# Altium project SENSEI_Base-Board.PrjPcb (part 1 of 3)
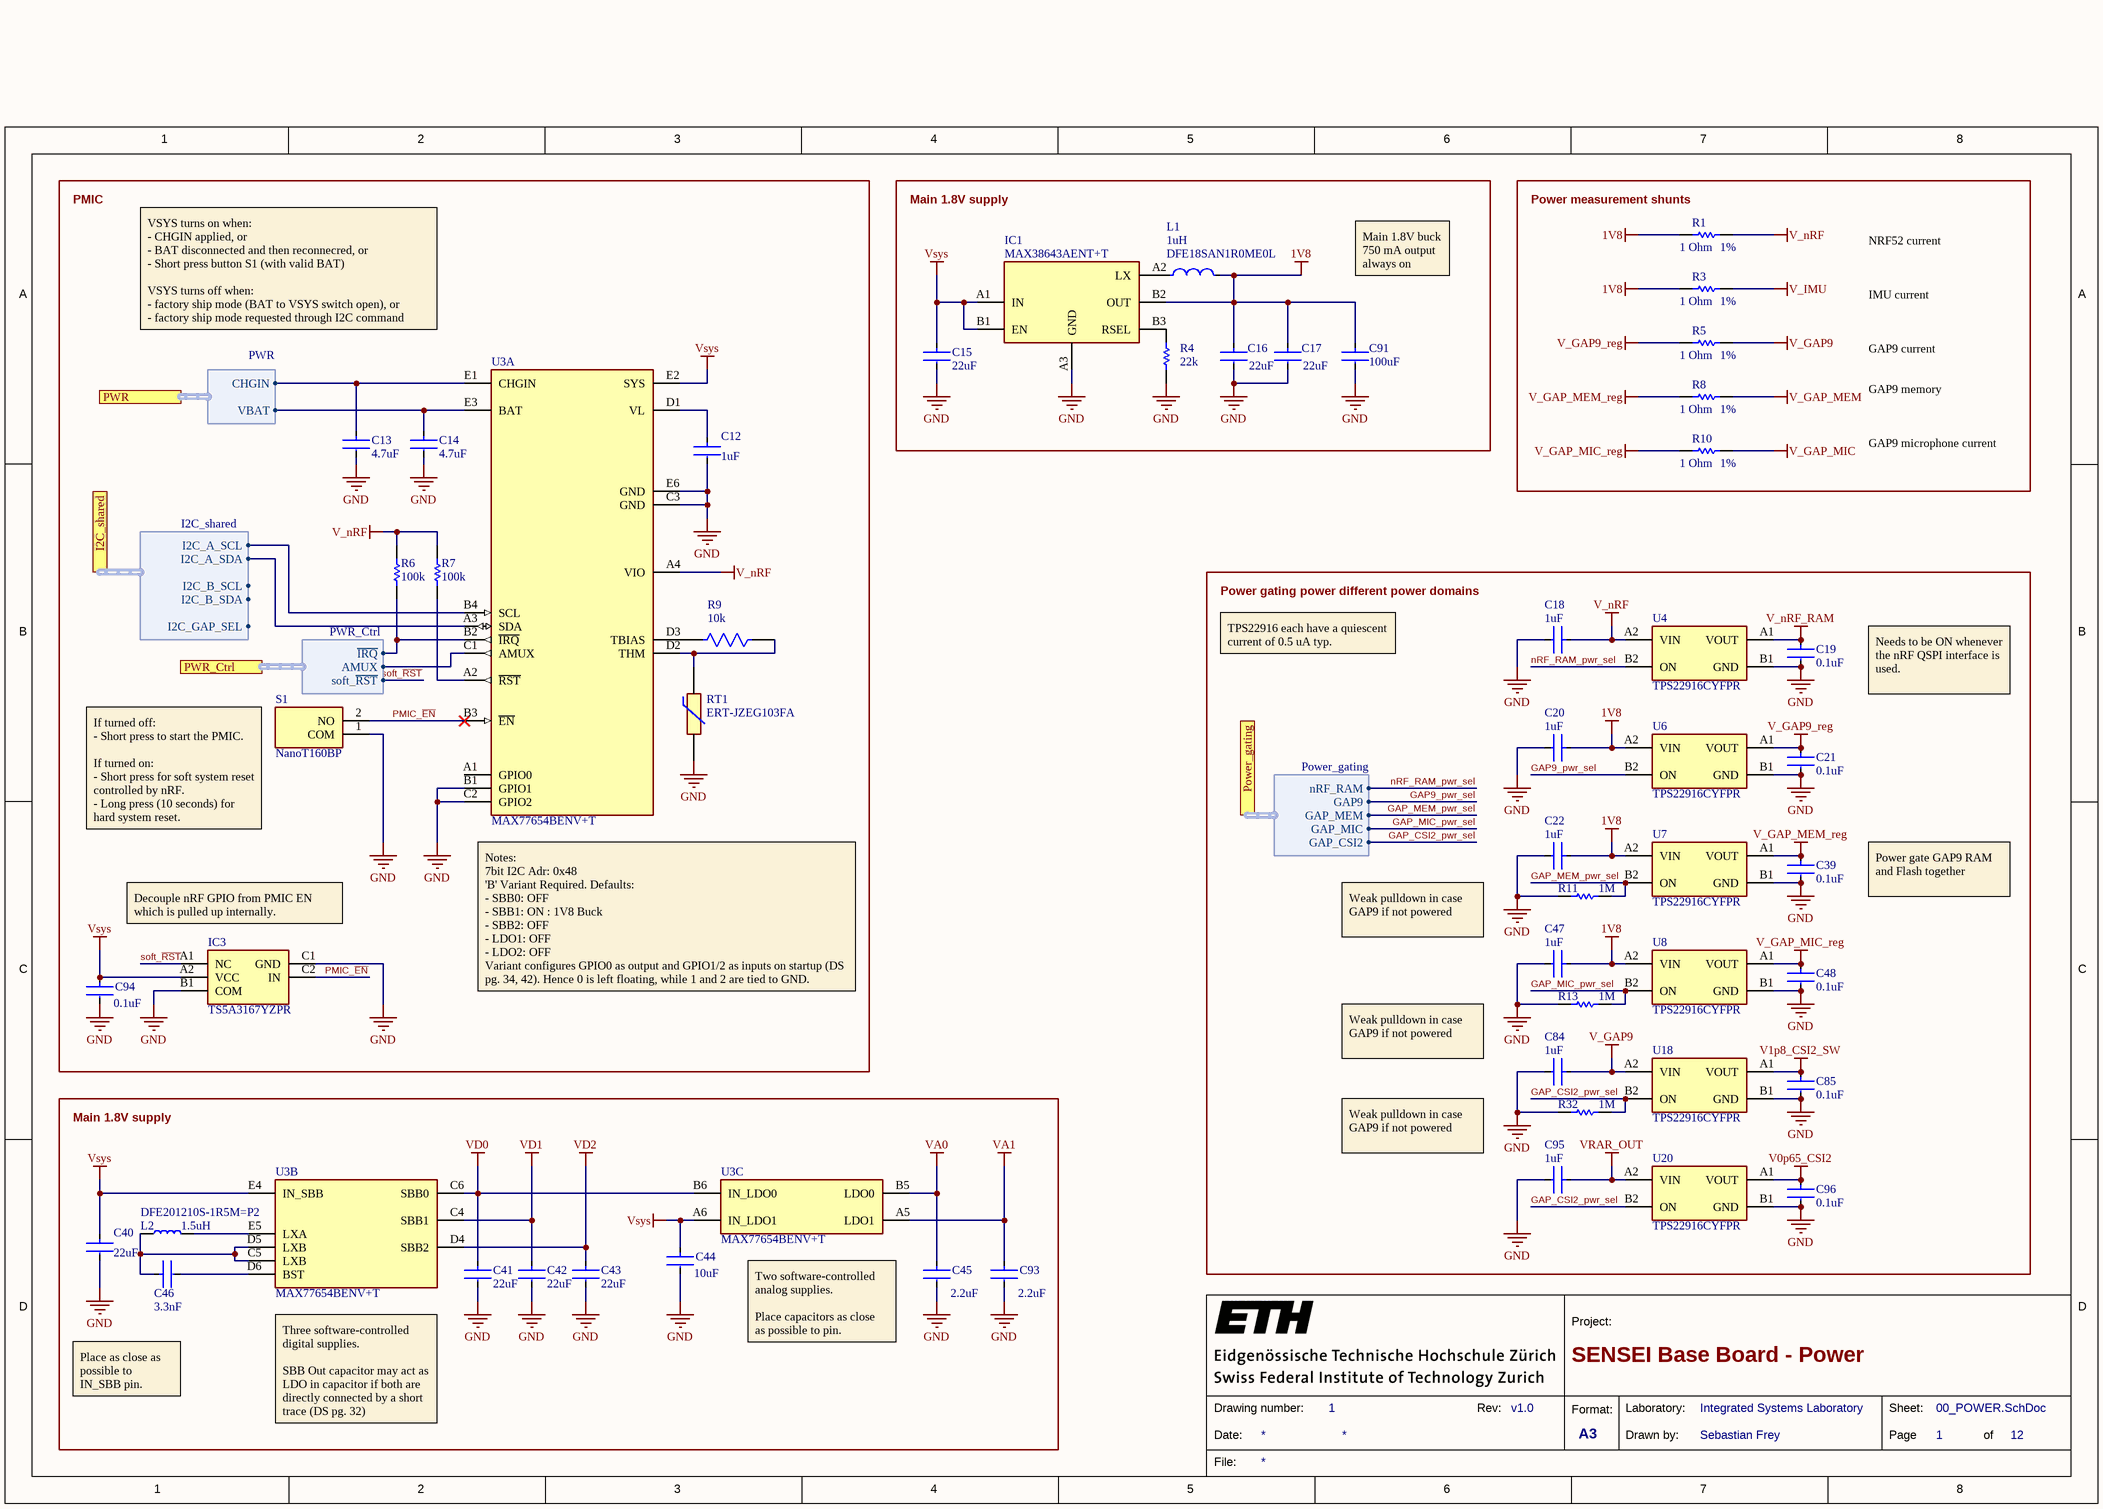
[diagram p0: 00_POWER.SchDoc]
revision: v1.0; title: SENSEI Base Board
12 sheets, 210 parts. Net scope: flat (ports and power ports of the same name join across sheets).
Board files: SENSEI_Base-Board.PcbDoc, SENSEI_Base-Board_Clean.PcbDoc
Sheets:
  00_POWER.SchDoc
  01_GAP_POWER.SchDoc
  02_GAP_JTAG_XTALs.SchDoc
  03_GAP_MEM.SchDoc
  04_GAP_GPIO.SchDoc
  05_GAP_MIC.SchDoc
  06_nRF_POWER_SWD_RF.SchDoc
  07_nRF_GPIO.SchDoc
  08_nRF_RAM.SchDoc
  09_SHARED_PERIPHERAL.SchDoc
  10_CONNECTOR.SchDoc
  11_BREAK_OFF.SchDoc

## Sheet 00_POWER.SchDoc: SENSEI Base Board - Power
size A3; DrawnBy: Sebastian Frey; Organization: Integrated Systems Laboratory; DocumentNumber: 1; Revision: v1.0; SheetNumber: 1; SheetTotal: 12

### Parts
(Parts that share a designator on the sheet are numbered #1, #2 ... from top to bottom, then left to right.)
C12  Capacitance: 1uF  [FP-CL03-IPC_B]  (hidden comment: CL03A105KP3NSNC)
C13  Capacitance: 4.7uF  [FP-C1005-050-0_15-IPC_C]  (hidden comment: C1005X5R0J475K050BC)
C14  Capacitance: 4.7uF  [FP-C1005-050-0_15-IPC_C]  (hidden comment: C1005X5R0J475K050BC)
C15  Capacitance: 22uF  [FP-CL746-IPC_C]  (hidden comment: CL05A226MQ5QUNC)
C16  Capacitance: 22uF  [FP-CL746-IPC_C]  (hidden comment: CL05A226MQ5QUNC)
C17  Capacitance: 22uF  [FP-CL746-IPC_C]  (hidden comment: CL05A226MQ5QUNC)
C18  Capacitance: 1uF  [FP-CL03-IPC_B]  (hidden comment: CL03A105KP3NSNC)
C19  Capacitance: 0.1uF  [FP-GRM033-0_03-IPC_B]  (hidden comment: GRM033Z71C104KE14D)
C20  Capacitance: 1uF  [FP-CL03-IPC_B]  (hidden comment: CL03A105KP3NSNC)
C21  Capacitance: 0.1uF  [FP-GRM033-0_03-IPC_B]  (hidden comment: GRM033Z71C104KE14D)
C22  Capacitance: 1uF  [FP-CL03-IPC_B]  (hidden comment: CL03A105KP3NSNC)
C39  Capacitance: 0.1uF  [FP-GRM033-0_03-IPC_B]  (hidden comment: GRM033Z71C104KE14D)
C40  Capacitance: 22uF  [FP-CL746-IPC_C]  (hidden comment: CL05A226MQ5QUNC)
C41  Capacitance: 22uF  [FP-CL746-IPC_C]  (hidden comment: CL05A226MQ5QUNC)
C42  Capacitance: 22uF  [FP-CL746-IPC_C]  (hidden comment: CL05A226MQ5QUNC)
C43  Capacitance: 22uF  [FP-CL746-IPC_C]  (hidden comment: CL05A226MQ5QUNC)
C44  Capacitance: 10uF  [FP-CL05A106MP5NUNC-IPC_C]  (hidden comment: CL05A106MP5NUNC)
C45  Capacitance: 2.2uF  [FP-GRM155-0_2-IPC_C]  (hidden comment: GRM155C70J225KE11D)
C46  Capacitance: 3.3nF  [FP-GRM033-0_03-IPC_A]  (hidden comment: GRM033R71E332KA12D)
C47  Capacitance: 1uF  [FP-CL03-IPC_B]  (hidden comment: CL03A105KP3NSNC)
C48  Capacitance: 0.1uF  [FP-GRM033-0_03-IPC_B]  (hidden comment: GRM033Z71C104KE14D)
C84  Capacitance: 1uF  [FP-CL03-IPC_B]  (hidden comment: CL03A105KP3NSNC)
C85  Capacitance: 0.1uF  [FP-GRM033-0_03-IPC_B]  (hidden comment: GRM033Z71C104KE14D)
C91  Capacitance: 100uF  [FP-GRM21B-0_2-e0_2_0_7-MFG]  (hidden comment: GRM21BR60G107ME11L)
C93  Capacitance: 2.2uF  [FP-GRM155-0_2-IPC_C]  (hidden comment: GRM155C70J225KE11D)
C94  Capacitance: 0.1uF  [FP-GRM033-0_03-IPC_B]  (hidden comment: GRM033Z71C104KE14D)
C95  Capacitance: 1uF  [FP-CL03-IPC_B]  (hidden comment: CL03A105KP3NSNC)
C96  Capacitance: 0.1uF  [FP-GRM033-0_03-IPC_B]  (hidden comment: GRM033Z71C104KE14D)
IC1  MAX38643AENT+T  [BGA6C40P3X2_142X89X50]
IC3  TS5A3167YZPR  [BGA5C50P2X3_89X139X50]
L1  DFE18SAN1R0ME0L  Inductance: 1uH  [FP-DFE18SAN_E0-MFG]
L2  DFE201210S-1R5M=P2  Inductance: 1.5uH  [IND_0805_DFE201210S]
R1  value 1 Ohm  Tolerance: 1%  [RESC1005X40X25LL05T10]  (hidden comment: CRCW04021R00FKEDHP)
R3  value 1 Ohm  Tolerance: 1%  [RESC1005X40X25LL05T10]  (hidden comment: CRCW04021R00FKEDHP)
R4#1  Resistance: 22k  [RESC0603X26X15LL03T05]  (hidden comment: RK73H1HTTC2202F)
R5  value 1 Ohm  Tolerance: 1%  [RESC1005X40X25LL05T10]  (hidden comment: CRCW04021R00FKEDHP)
R6  value 100k  [RESC0201(0603)_L]  (hidden comment: RC0201FR-07100KL)
R7  value 100k  [RESC0201(0603)_L]  (hidden comment: RC0201FR-07100KL)
R8  value 1 Ohm  Tolerance: 1%  [RESC1005X40X25LL05T10]  (hidden comment: CRCW04021R00FKEDHP)
R9  Resistance: 10k  [FP-RMCF0201-IPC_C]  (hidden comment: RMCF0201FT10K0)
R10  value 1 Ohm  Tolerance: 1%  [RESC1005X40X25LL05T10]  (hidden comment: CRCW04021R00FKEDHP)
R11  value 1M  [RESC0201(0603)_L]  (hidden comment: ERJ-1GNJ105C)
R13  value 1M  [RESC0201(0603)_L]  (hidden comment: ERJ-1GNJ105C)
R32  value 1M  [RESC0201(0603)_L]  (hidden comment: ERJ-1GNJ105C)
RT1  ERT-JZEG103FA  [ERTJZEG103FA]
S1  NanoT160BP  [NanoT160BP]
U3  MAX77654BENV+T  [WLP_30_MAX77654]  (parts A,B,C of 3)
U4  TPS22916CYFPR  [BGA4C40P2X2_78X78X50]
U6  TPS22916CYFPR  [BGA4C40P2X2_78X78X50]
U7  TPS22916CYFPR  [BGA4C40P2X2_78X78X50]
U8  TPS22916CYFPR  [BGA4C40P2X2_78X78X50]
U18  TPS22916CYFPR  [BGA4C40P2X2_78X78X50]
U20  TPS22916CYFPR  [BGA4C40P2X2_78X78X50]

### Blocks framed on the sheet
PMIC: C12-C14 C94 IC3 R6 R7 R9 RT1 S1 U3
Main 1.8V supply: C15-C17 C91 IC1 L1 R4#1
Power measurement shunts: R1 R3 R5 R8 R10
Power gating power different power domains: C18-C22 C39 C47 C48 C84 C85 C95 C96 R11 R13 R32 U4 U6-U8 U18 U20
Main 1.8V supply: C40-C46 C93 L2 U3

### Ports
I2C_shared (harness I2C_shared), Power_gating (harness Power_gating), PWR (harness PWR), PWR_Ctrl (harness PWR_Ctrl)

### Harnesses
PWR: CHGIN, VBAT
PWR_Ctrl: ~{IRQ}, AMUX, soft_~{RST}
Power_gating: nRF_RAM, GAP9, GAP_MEM, GAP_MIC, GAP_CSI2
I2C_shared: I2C_A_SCL, I2C_A_SDA, I2C_B_SCL, I2C_B_SDA, I2C_GAP_SEL

### Nets
1V8: C16.1 C17.1 C20.1 C22.1 C47.1 C91.1 IC1.B2(OUT) L1.2 R1.1 R3.1 U6.A2(VIN) U7.A2(VIN) U8.A2(VIN)
GND: C12.2 C13.2 C14.2 C15.2 C16.2 C17.2 C18.2 C19.2 C20.2 C21.2 C22.2 C39.2 C40.2 C41.2 C42.2 C43.2 C44.2 C45.2 C47.2 C48.2 C84.2 C85.2 C91.2 C93.2 C94.2 C95.2 C96.2 IC1.A3(GND) IC3.B1(COM) IC3.C1(GND) R4#1.1 R11.1 R13.1 R32.1 RT1.2 S1.1(COM) U3.B1(GPIO1) U3.C2(GPIO2) U3.C3(GND) U3.E6(GND) U4.B1(GND) U6.B1(GND) U7.B1(GND) U8.B1(GND) U18.B1(GND) U20.B1(GND)
V0p65_CSI2: C96.1 U20.A1(VOUT)
V1p8_CSI2_SW: C85.1 U18.A1(VOUT)
V_GAP9: C84.1 R5.2 U18.A2(VIN)
V_GAP9_reg: C21.1 R5.1 U6.A1(VOUT)
V_GAP_MEM: R8.2
V_GAP_MEM_reg: C39.1 R8.1 U7.A1(VOUT)
V_GAP_MIC: R10.2
V_GAP_MIC_reg: C48.1 R10.1 U8.A1(VOUT)
V_IMU: R3.2
V_nRF: C18.1 R1.2 R6.2 R7.2 U3.A4(VIO) U4.A2(VIN)
V_nRF_RAM: C19.1 U4.A1(VOUT)
VA0: C45.1 U3.B5(LDO0)
VA1: C93.1 U3.A5(LDO1)
VD0: C41.1 U3.B6(IN_LDO0) U3.C6(SBB0)
VD1: C42.1 U3.C4(SBB1)
VD2: C43.1 U3.D4(SBB2)
VRAR_OUT: C95.1 U20.A2(VIN)
Vsys: C15.1 C40.1 C44.1 C94.1 IC1.A1(IN) IC1.B1(EN) IC3.A2(VCC) U3.A6(IN_LDO1) U3.E2(SYS) U3.E4(IN_SBB)
EXT_CHG/VUSB: C13.1 U3.E1(CHGIN) ; port PWR.CHGIN
GAP9_pwr_sel: U6.B2(ON) ; port Power_gating.GAP9
GAP_CSI2_pwr_sel: R32.2 U18.B2(ON) U20.B2(ON) ; port Power_gating.GAP_CSI2
GAP_MEM_pwr_sel: R11.2 U7.B2(ON) ; port Power_gating.GAP_MEM
GAP_MIC_pwr_sel: R13.2 U8.B2(ON) ; port Power_gating.GAP_MIC
I2C_A_SCL: U3.B4(SCL) ; port I2C_shared.I2C_A_SCL
I2C_A_SDA: U3.A3(SDA) ; port I2C_shared.I2C_A_SDA
nRF_P0.07/AMUX: U3.C1(AMUX) ; port PWR_Ctrl.AMUX
nRF_RAM_pwr_sel: U4.B2(ON) ; port Power_gating.nRF_RAM
PMIC_~{EN}: IC3.C2(IN) S1.2(NO) U3.B3(~{EN})
PMIC_~{IRQ}: R6.1 U3.B2(~{IRQ}) ; port PWR_Ctrl.~{IRQ}
soft_~{RST}: IC3.A1(NC) ; port PWR_Ctrl.soft_~{RST}
VBAT: C14.1 U3.E3(BAT) ; port PWR.VBAT
NetC12_1: C12.1 U3.D1(VL)
NetC46_1: C46.1 L2.1 U3.C5(LXB) U3.D5(LXB)
NetC46_2: C46.2 U3.D6(BST)
NetIC1_A2: IC1.A2(LX) L1.1
NetIC1_B3: IC1.B3(RSEL) R4#1.2
NetL2_2: L2.2 U3.E5(LXA)
NetR7_1: R7.1 U3.A2(~{RST})
NetR9_1: R9.1 RT1.1 U3.D2(THM)
NetR9_2: R9.2 U3.D3(TBIAS)

Not connected (* = marked no-connect by the designer): U3 A1(GPIO0)

### Notes on the sheet
- NRF52 current
- Main 1.8V buck
  750 mA output
  always on
- IMU current
- VSYS turns on when:
  - CHGIN applied, or
  - BAT disconnected and then reconnecred, or
  - Short press button S1 (with valid BAT)
  VSYS turns off when:
  - factory ship mode (BAT to VSYS switch open), or
  - factory ship mode requested through I2C command
- GAP9 current
- GAP9 memory current
- GAP9 microphone current
- TPS22916 each have a quiescent current of 0.5 uA typ.
- Needs to be ON whenever the nRF QSPI interface is used.
- If turned off:
  - Short press to start the PMIC.
  If turned on:
  - Short press for soft system reset controlled by nRF.
  - Long press (10 seconds) for hard system reset.
- (near IC3) Decouple nRF GPIO from PMIC EN which is pulled up internally.
- Power gate GAP9 RAM and Flash together
- (near U3) Notes:
  7bit I2C Adr: 0x48
  'B' Variant Required. Defaults:
  - SBB0: OFF
  - SBB1: ON : 1V8 Buck
  - SBB2: OFF
  - LDO1: OFF
  - LDO2: OFF
  Variant configures GPIO0 as output and GPIO1/2 as inputs on startup (DS pg. 34, 42). Hence 0 is left floating, while 1 and 2 are tied to GND.
- Weak pulldown in case GAP9 if not powered
- Place as close as
  possible to
  IN_SBB pin.
- Two software-controlled
  analog supplies.
  Place capacitors as close
  as possible to pin.
- Three software-controlled
  digital supplies.
  SBB Out capacitor may act as
  LDO in capacitor if both are
  directly connected by a short
  trace (DS pg. 32)
- 1
- 2
- 3
- 4
- 5
- 6
- 7
- 8
- A
- B
- C
- D
- Project:
- Date:
- Drawing number:
- Rev:
- Format:
- A3
- Drawn by:
- Laboratory:
- Page
- Sheet:
- of
- File:

### Library data of the parts
C12 C18 C20 C22 C47 C84 C95 = CMP-13271-003594-1: Cap Ceramic 1uF 10V X5R ±10% Pad SMD 0201 +85°C T/R; Min Operating Temperature: -55°C; Mount: Surface Mount; Packaging: Cut Tape; Width: 0.012inch; Tolerance: 10%; Case Code (Imperial): 0201; Thickness: 0.013inch; Length: 0.024inch; Case/Package: 0201; Max Operating Temperature: 85°C; Voltage Rating: 10V; Case Code (Metric): 0603
C13 C14 = CMP-2000-05437-2: CAP CER 4.7UF 6.3V X5R 0402; Tolerance: 10%; Dielectric Material: Ceramic; Voltage: 6.3V; Depth: 0.5mm; Height: 0.5mm; Length: 1mm; Termination: SMD/SMT; RoHS Compliant: Yes; Series: C; Case/Package: 0402; Dielectric: X5R; Lead Free: Lead Free; Mount: Surface Mount; Max Operating Temperature: 85°C; Min Operating Temperature: -55°C
C15-C17 C40-C43 = CMP-13271-000286-1: Cap Ceramic 22uF 6.3V X5R ±20% SMD 0402 +85°C Paper T/R; Case Code (Imperial): 0402; Tolerance: 20%; Width: 0.02inch; Packaging: Tape and Reel; Case/Package: 0402; Min Operating Temperature: -55°C; Max Operating Temperature: 85°C; Voltage Rating: 6.3V; Thickness: 0.022inch; Mount: Surface Mount; Length: 0.039inch; Case Code (Metric): 1005
C19 C21 C39 C48 C85 C94 C96 = CMP-06035-035508-1: Chip Multilayer Ceramic Capacitors for General Purpose, 0201, 0.10uF, X7R, 15%, 10%, 16V; Case/Package: 0201
C44 = CMP-13271-000002-1: CAP CER 10UF 10V X5R 0402; Manufacturer: Samsung; Temperature Coefficient: 15%; Tolerance: 20%; Material: Ceramic; Octopart: https://octopart.com/cl05a106mp5nunc-samsung-22457395; Voltage Rating: 10V; RoHS: TRUE; Value: 10uF; Height: 0.7mm; Digikey Description: CAP CER 10UF 10V X5R 0402; Automotive: No; Package: CL05A106MP5NUNC; Device Class L1: Passive Components; Temperature Range High: +85°C; ComponentLink2Description: Datasheet; Device Class L2: Capacitors; Temperature Characteristic: X5R; Manufacturer Part Number: CL05A106MP5NUNC; Temperature: -55°C to +85°C; ComponentLink2URL: http://www.samsungsem.com/kr/support/product-search/mlcc/__icsFiles/afieldfile/2019/05/10/19-CL05A106MP5NUNC.pdf; Device Class L3: Ceramic Capacitors; Category: Cap; Temperature Range Low: -55°C; Ipc Land Pattern Name: CAPC10050X50; Lead Free: Yes
C45 C93 = CMP-06035-014902-1: Chip Multilayer Ceramic Capacitors for General Purpose, 0402, 2.2uF, X7S, 22%, 10%, 6.3V; Dielectric: X7S; Case Code (Metric): 1005; Case/Package: 0402; Voltage Rating (DC): 6.3V; Length: 0.039inch; Max Operating Temperature: 125°C; Tolerance: 10%; Width: 0.02inch; Mount: Surface Mount; Packaging: Tape and Reel; Package Quantity: 10000; Voltage Rating: 6.3V; Resistor Type: Ceramic; Min Operating Temperature: -55°C; Case Code (Imperial): 0402; Termination: SMD/SMT; Weight: 0.000212oz; Height: 0.5mm; Thickness: 0.022inch
C46 = CMP-06035-035563-1: Chip Multilayer Ceramic Capacitors for General Purpose, 0201, 3300pF, X7R, 15%, 10%, 25V; Mount: Surface Mount; Voltage Rating: 25V; Max Operating Temperature: 125°C; Height: 0.3mm; Resistor Type: Ceramic; Case/Package: 0201; Case Code (Imperial): 0201; Min Operating Temperature: -55°C; Packaging: Tape and Reel; Weight: 1.2E-05oz; Thickness: 0.013inch; Voltage Rating (DC): 25V; Case Code (Metric): 0603; Package Quantity: 15000; Width: 0.012inch; Dielectric: X7R; Tolerance: 10%; Termination: SMD/SMT; Length: 0.024inch
C91 = CMP-06035-033356-1: Chip Multilayer Ceramic Capacitors for General Purpose, 0805, 100uF, X5R, 15%, 20%, 4V; Length: 0.079inch; Voltage Rating (DC): 4V; Min Operating Temperature: -55°C; Dielectric: X5R; Case Code (Metric): 2012; Case/Package: 0805; Voltage Rating: 4V; Width: 0.049inch; Case Code (Imperial): 0805; Mount: Surface Mount; Packaging: Tape and Reel; Thickness: 0.057inch; Tolerance: 20%; Max Operating Temperature: 85°C
IC1 = MAX38643AENT+: Integrated Circuit; Manufacturer_Name: Analog Devices; Datasheet Link: https://www.mouser.com/datasheet/2/256/MAX38640A-MAX38643B-1516623.pdf; Height: 0.5mm; Manufacturer_Part_Number: MAX38643AENT+; Mouser Part Number: 700-MAX38643AENT+; Mouser Price/Stock: https://www.mouser.co.uk/ProductDetail/Maxim-Integrated/MAX38643AENT%2b?qs=PzGy0jfpSMssjCGgbzOt4w%3D%3D
IC3 = TS5A3167YZPR: Integrated Circuit; Manufacturer_Name: Texas Instruments; Datasheet Link: http://www.ti.com/lit/gpn/ts5a3167; Height: 0.5mm; Manufacturer_Part_Number: TS5A3167YZPR; Mouser Part Number: 595-TS5A3167YZPR; Mouser Price/Stock: https://www.mouser.co.uk/ProductDetail/Texas-Instruments/TS5A3167YZPR/?qs=0O%2FZFlpUpJV2gM0iE3NeCQ%3D%3D; Arrow Part Number: TS5A3167YZPR; Arrow Price/Stock: https://www.arrow.com/en/products/ts5a3167yzpr/texas-instruments
L1 = CMP-06042-016331-1: FIXED IND 1UH 1.6A 144 MOHM SMD; Saturation Current: 2A; DC Resistance (DCR): 144mR; Shielding: Shielded; Core Material: Metal; Tolerance: 20%; Test Frequency: 1MHz; Mount: Surface Mount; Min Operating Temperature: -40°C; Current Rating: 1.6A; Case Code (Imperial): 0603; RoHS Compliant: Yes; Max Operating Temperature: 85°C; Case/Package: 0603; Packaging: Cut Tape; Case Code (Metric): 1608
L2 = L_0805_1.5uH_2A: L 1.5uH 2A 0805; Manufacturer: Murata; Supplier 1: Mouser; Manufacturer Part Number: DFE201210S-1R5M=P2; Supplier Part Number 1: 81-DFE201210S-1R5MP2
R1 R3 R5 R8 R10 = CMP-2002-03047-1: Manufacturer: Vishay Dale; Part Number: CRCW04021R00FKEDHP
R4#1 = CMP-2004-01604-1: Manufacturer: KOA Speer; Part Number: RK73H1HTTC2202F
R6 R7 = CMP-1010-00642-1: 100K 0.05W 1% 0201 (0603 Metric)  SMD; Case-EIA: 0201; Case-Metric: 0603; Technology: SMT; Power: 0.05 W; Tolerance: 1 %
R9 = CMP-26527-002755-1: RES 10K OHM 1% 1/20W 0201; Max Power Dissipation: 50mW; Temperature Coefficient: 200ppm/°C; Length: 0.024inch; Min Operating Temperature: -55°C; Width: 0.012inch; Contact Plating: Tin; Case/Package: 0201; Power Rating: 50mW; Packaging: Tape and Reel; Resistor Type: Thick Film; Case Code (Metric): 0603; Tolerance: 1%; Case Code (Imperial): 0201; Max Operating Temperature: 125°C; Height: 0.009inch; Mount: Surface Mount; Series: RMCF; RoHS Compliant: Yes; Number of Terminations: 2
R11 R13 R32 = CMP-1010-00146-1: 1M 0.05W 5% 0201 (0603 Metric)  SMD; Case-Metric: 0603; Case-EIA: 0201; Technology: SMT; Tolerance: 5 %; Power: 0.05 W
RT1 = ERT-JZEG103FA: Thermistor; Manufacturer_Name: Panasonic; Datasheet Link: https://industrial.panasonic.com/cdbs/www-data/pdf/AUA0000/AUA0000C8.pdf; Height: 0.33mm; Manufacturer_Part_Number: ERT-JZEG103FA; Mouser Part Number: 667-ERT-JZEG103FA; Mouser Price/Stock: https://www.mouser.co.uk/ProductDetail/Panasonic/ERT-JZEG103FA?qs=8rMlxy%252BA7jnazXT5AW8efg%3D%3D; Arrow Part Number: ERT-JZEG103FA; Arrow Price/Stock: https://www.arrow.com/en/products/ert-jzeg103fa/panasonic?region=nac
S1 = NanoT160BP: Switch; Manufacturer_Name: LITTELFUSE; Datasheet Link: https://www.ckswitches.com/media/2866/nanot.pdf; Height: 1mm; Manufacturer_Part_Number: NanoT160BP
U3 = MAX77654BENV+T: Buck-Boost Converter With LDO Regulator 5-OUT 30-Pin WLP T/R; Manufacturer: Maxim; Manufacturer Part Number: MAX77654BENV+T; Supplier 1: Mouser; Supplier Part Number 1: 700-MAX77654BENV+T
U4 U6-U8 U18 U20 = TPS22916CYFPR: Integrated Circuit; Manufacturer_Name: Texas Instruments; Datasheet Link: http://www.ti.com/lit/gpn/tps22916; Height: 0.5mm; Manufacturer_Part_Number: TPS22916CYFPR; Mouser Part Number: 595-TPS22916CYFPR; Mouser Price/Stock: https://www.mouser.co.uk/ProductDetail/Texas-Instruments/TPS22916CYFPR?qs=EU6FO9ffTweddKR4NsfVQg%3D%3D; Arrow Part Number: TPS22916CYFPR; Arrow Price/Stock: https://www.arrow.com/en/products/tps22916cyfpr/texas-instruments?region=nac

## Sheet 01_GAP_POWER.SchDoc: SENSEI Base Board - GAP Power
size A3; DrawnBy: Sebastian Frey; Organization: Integrated Systems Laboratory; DocumentNumber: 2; Revision: v1.0; SheetNumber: 2; SheetTotal: 12
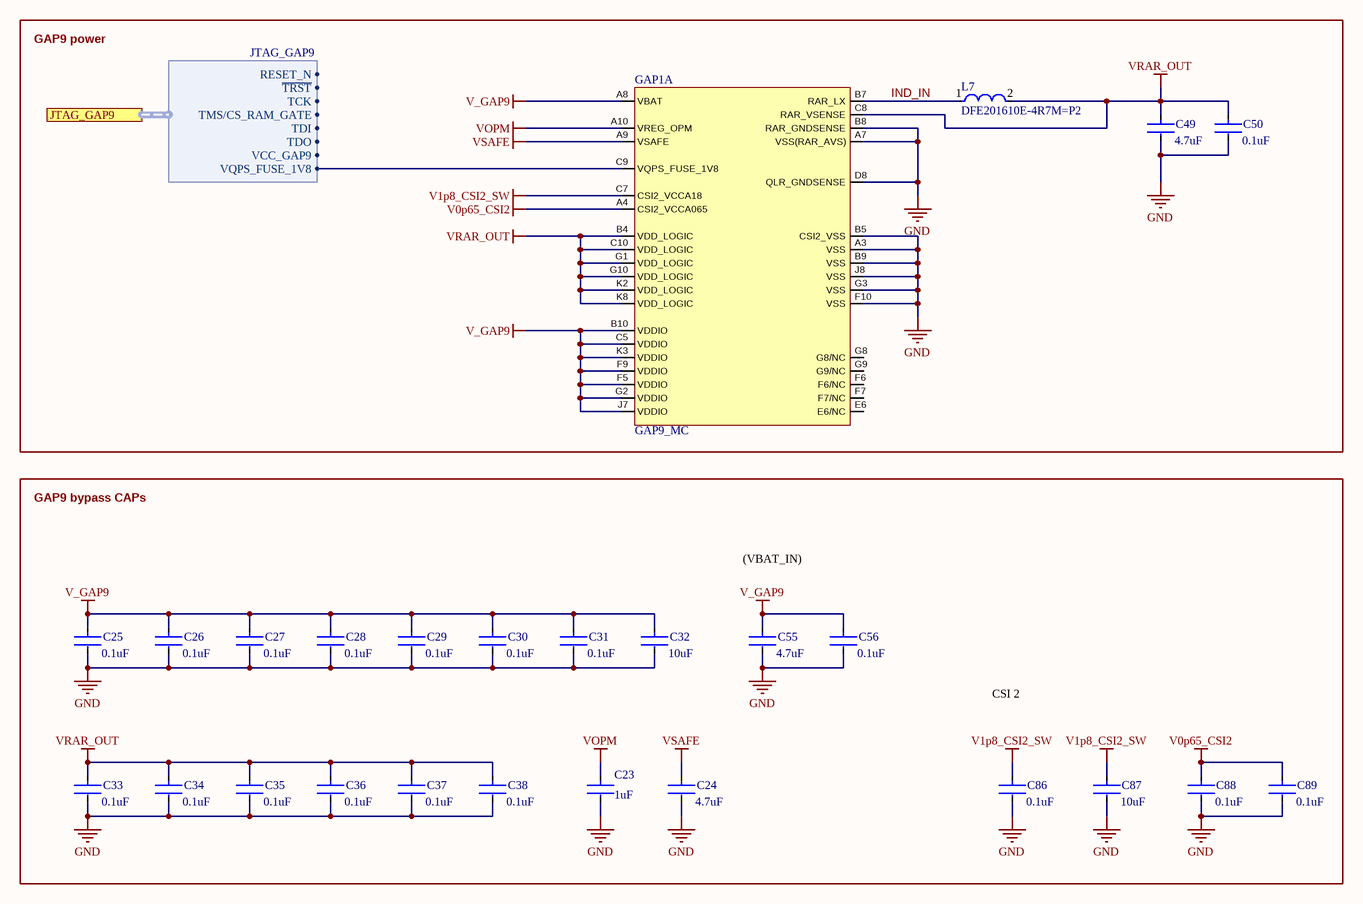
[diagram p1: 01_GAP_POWER.SchDoc]

### Parts
C23  Capacitance: 1uF  [FP-CL03-IPC_B]  (hidden comment: CL03A105KP3NSNC)
C24  Capacitance: 4.7uF  [FP-C1005-050-0_15-IPC_B]  (hidden comment: C1005X5R0J475K050BC)
C25  Capacitance: 0.1uF  [FP-GRM033-0_03-IPC_B]  (hidden comment: GRM033Z71C104KE14D)
C26  Capacitance: 0.1uF  [FP-GRM033-0_03-IPC_B]  (hidden comment: GRM033Z71C104KE14D)
C27  Capacitance: 0.1uF  [FP-GRM033-0_03-IPC_B]  (hidden comment: GRM033Z71C104KE14D)
C28  Capacitance: 0.1uF  [FP-GRM033-0_03-IPC_B]  (hidden comment: GRM033Z71C104KE14D)
C29  Capacitance: 0.1uF  [FP-GRM033-0_03-IPC_B]  (hidden comment: GRM033Z71C104KE14D)
C30  Capacitance: 0.1uF  [FP-GRM033-0_03-IPC_B]  (hidden comment: GRM033Z71C104KE14D)
C31  Capacitance: 0.1uF  [FP-GRM033-0_03-IPC_B]  (hidden comment: GRM033Z71C104KE14D)
C32  Capacitance: 10uF  [FP-CL05A106MP5NUNC-IPC_B]  (hidden comment: CL05A106MP5NUNC)
C33  Capacitance: 0.1uF  [FP-GRM033-0_03-IPC_B]  (hidden comment: GRM033Z71C104KE14D)
C34  Capacitance: 0.1uF  [FP-GRM033-0_03-IPC_B]  (hidden comment: GRM033Z71C104KE14D)
C35  Capacitance: 0.1uF  [FP-GRM033-0_03-IPC_B]  (hidden comment: GRM033Z71C104KE14D)
C36  Capacitance: 0.1uF  [FP-GRM033-0_03-IPC_B]  (hidden comment: GRM033Z71C104KE14D)
C37  Capacitance: 0.1uF  [FP-GRM033-0_03-IPC_B]  (hidden comment: GRM033Z71C104KE14D)
C38  Capacitance: 0.1uF  [FP-GRM033-0_03-IPC_B]  (hidden comment: GRM033Z71C104KE14D)
C49  Capacitance: 4.7uF  [FP-C1005-050-0_15-IPC_B]  (hidden comment: C1005X5R0J475K050BC)
C50  Capacitance: 0.1uF  [FP-GRM033-0_03-IPC_B]  (hidden comment: GRM033Z71C104KE14D)
C55  Capacitance: 4.7uF  [FP-C1005-050-0_15-IPC_B]  (hidden comment: C1005X5R0J475K050BC)
C56  Capacitance: 0.1uF  [FP-GRM033-0_03-IPC_B]  (hidden comment: GRM033Z71C104KE14D)
C86  Capacitance: 0.1uF  [FP-GRM033-0_03-IPC_B]  (hidden comment: GRM033Z71C104KE14D)
C87  Capacitance: 10uF  [FP-CL05A106MP5NUNC-IPC_B]  (hidden comment: CL05A106MP5NUNC)
C88  Capacitance: 0.1uF  [FP-GRM033-0_03-IPC_B]  (hidden comment: GRM033Z71C104KE14D)
C89  Capacitance: 0.1uF  [FP-GRM033-0_03-IPC_B]  (hidden comment: GRM033Z71C104KE14D)
GAP1  GAP9_MC  [GAP9]  (part A of 5)
L7  DFE201610E-4R7M=P2  [FP-DFE201610C-MFG]

### Blocks framed on the sheet
GAP9 power: C49 C50 GAP1 L7
GAP9 bypass CAPs: C23-C38 C55 C56 C86-C89

### Ports
JTAG_GAP9 (harness JTAG_GAP9)

### Harnesses
JTAG_GAP9: ~{TRST}, TCK, TMS/CS_RAM_GATE, TDI, TDO, VCC_GAP9, RESET_N, VQPS_FUSE_1V8

### Nets
GND: C23.2 C24.2 C25.2 C26.2 C27.2 C28.2 C29.2 C30.2 C31.2 C32.2 C33.2 C34.2 C35.2 C36.2 C37.2 C38.2 C49.2 C50.2 C55.2 C56.2 C86.2 C87.2 C88.2 C89.2 GAP1.A3(VSS) GAP1.A7(VSS(RAR_AVS)) GAP1.B5(CSI2_VSS) GAP1.B8(RAR_GNDSENSE) GAP1.B9(VSS) GAP1.D8(QLR_GNDSENSE) GAP1.F10(VSS) GAP1.G3(VSS) GAP1.J8(VSS)
V0p65_CSI2: C88.1 C89.1 GAP1.A4(CSI2_VCCA065)
V1p8_CSI2_SW: C86.1 C87.1 GAP1.C7(CSI2_VCCA18)
V_GAP9: C25.1 C26.1 C27.1 C28.1 C29.1 C30.1 C31.1 C32.1 C55.1 C56.1 GAP1.A8(VBAT) GAP1.B10(VDDIO) GAP1.C5(VDDIO) GAP1.F5(VDDIO) GAP1.F9(VDDIO) GAP1.G2(VDDIO) GAP1.J7(VDDIO) GAP1.K3(VDDIO) ; port JTAG_GAP9.VCC_GAP9
VOPM: C23.1 GAP1.A10(VREG_OPM)
VRAR_OUT: C33.1 C34.1 C35.1 C36.1 C37.1 C38.1 C49.1 C50.1 GAP1.B4(VDD_LOGIC) GAP1.C8(RAR_VSENSE) GAP1.C10(VDD_LOGIC) GAP1.G1(VDD_LOGIC) GAP1.G10(VDD_LOGIC) GAP1.K2(VDD_LOGIC) GAP1.K8(VDD_LOGIC) L7.2
VSAFE: C24.1 GAP1.A9(VSAFE)
IND_IN: GAP1.B7(RAR_LX) L7.1
VQPS_FUSE_1V8: GAP1.C9(VQPS_FUSE_1V8) ; port JTAG_GAP9.VQPS_FUSE_1V8

Not connected (* = marked no-connect by the designer): GAP1 E6(E6/NC) F6(F6/NC) F7(F7/NC) G8(G8/NC) G9(G9/NC)

### Notes on the sheet
- (VBAT_IN)
- CSI 2
- 1
- 2
- 3
- 4
- 5
- 6
- 7
- 8
- A
- B
- C
- D
- Project:
- Date:
- Drawing number:
- Rev:
- Format:
- A3
- Drawn by:
- Laboratory:
- Page
- Sheet:
- of
- File:

### Library data of the parts
C23 = CMP-13271-003594-1: as C12 on sheet 00_POWER; Min Operating Temperature: -55°C; Mount: Surface Mount; Packaging: Cut Tape; Width: 0.012inch; Tolerance: 10%; Case Code (Imperial): 0201; Thickness: 0.013inch; Length: 0.024inch; Case/Package: 0201; Max Operating Temperature: 85°C; Voltage Rating: 10V; Case Code (Metric): 0603
C24 C49 C55 = CMP-2000-05437-2: as C13 on sheet 00_POWER; Voltage: 6.3V; Depth: 0.5mm; Height: 0.5mm; Length: 1mm; Termination: SMD/SMT; RoHS Compliant: Yes; Series: C; Case/Package: 0402; Dielectric: X5R; Lead Free: Lead Free; Mount: Surface Mount; Max Operating Temperature: 85°C; Min Operating Temperature: -55°C
C25-C31 C33-C38 C50 C56 C86 C88 C89 = CMP-06035-035508-1: as C19 on sheet 00_POWER; Case/Package: 0201
C32 C87 = CMP-13271-000002-1: as C44 on sheet 00_POWER; Octopart: https://octopart.com/cl05a106mp5nunc-samsung-22457395; Voltage Rating: 10V; RoHS: TRUE; Value: 10uF; Height: 0.7mm; Digikey Description: CAP CER 10UF 10V X5R 0402; Automotive: No; Package: CL05A106MP5NUNC; Device Class L1: Passive Components; Temperature Range High: +85°C; ComponentLink2Description: Datasheet; Device Class L2: Capacitors; Temperature Characteristic: X5R; Manufacturer Part Number: CL05A106MP5NUNC; Temperature: -55°C to +85°C; ComponentLink2URL: http://www.samsungsem.com/kr/support/product-search/mlcc/__icsFiles/afieldfile/2019/05/10/19-CL05A106MP5NUNC.pdf; Device Class L3: Ceramic Capacitors; Category: Cap; Temperature Range Low: -55°C; Ipc Land Pattern Name: CAPC10050X50; Lead Free: Yes
L7 = CMP-06042-006199-1: Shielded Wirewound Inductor 4.7uH 20% 1100mA 0.288Ω 0806 (2016)

## Sheet 02_GAP_JTAG_XTALs.SchDoc: SENSEI Base Board - GAP JTAG & XTAL
size A3; DrawnBy: Sebastian Frey; Organization: Integrated Systems Laboratory; DocumentNumber: 3; Revision: v1.0; SheetNumber: 3; SheetTotal: 12
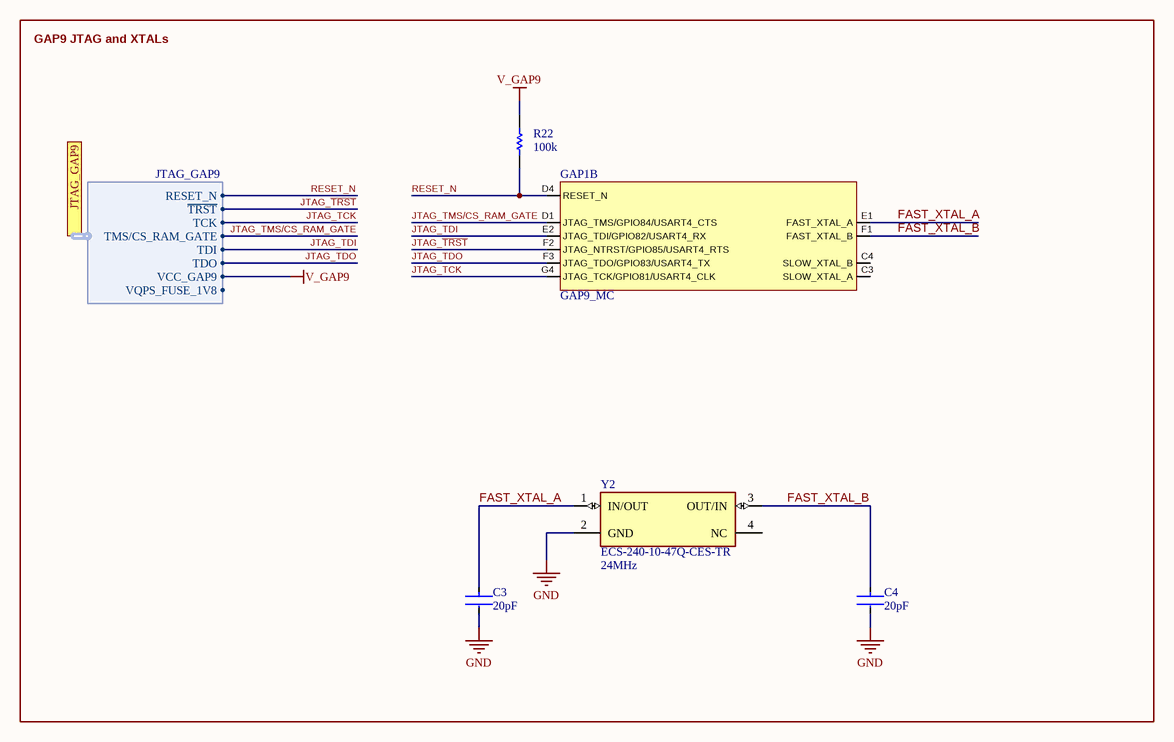
[diagram p2: 02_GAP_JTAG_XTALs.SchDoc]

### Parts
C3  Capacitance: 20pF  [CAPC6333_33N_KEM-L]  (hidden comment: CBR02C200F5GAC)
C4  Capacitance: 20pF  [CAPC6333_33N_KEM-L]  (hidden comment: CBR02C200F5GAC)
GAP1  GAP9_MC  [GAP9]  (part B of 5)
R22  Resistance: 100k  [RESC0201(0603)_L]  (hidden comment: RC0201FR-07100KL)
Y2  ECS-240-10-47Q-CES-TR  Frequency: 24MHz  [XTAL_ECS-240-10-47Q-CES-TR]

### Blocks framed on the sheet
GAP9 JTAG and XTALs: C3 C4 GAP1 R22 Y2

### Ports
JTAG_GAP9 (harness JTAG_GAP9)

### Harnesses
JTAG_GAP9: ~{TRST}, TCK, TMS/CS_RAM_GATE, TDI, TDO, VCC_GAP9, RESET_N, VQPS_FUSE_1V8

### Nets
GND: C3.2 C4.2 Y2.2(GND)
V_GAP9: R22.2 ; port JTAG_GAP9.VCC_GAP9
FAST_XTAL_A: C3.1 GAP1.E1(FAST_XTAL_A) Y2.1(IN/OUT)
FAST_XTAL_B: C4.1 GAP1.F1(FAST_XTAL_B) Y2.3(OUT/IN)
JTAG_~{TRST}: GAP1.F2(JTAG_NTRST/GPIO85/USART4_RTS) ; port JTAG_GAP9.~{TRST}
JTAG_TCK: GAP1.G4(JTAG_TCK/GPIO81/USART4_CLK) ; port JTAG_GAP9.TCK
JTAG_TDI: GAP1.E2(JTAG_TDI/GPIO82/USART4_RX) ; port JTAG_GAP9.TDI
JTAG_TDO: GAP1.F3(JTAG_TDO/GPIO83/USART4_TX) ; port JTAG_GAP9.TDO
JTAG_TMS/CS_RAM_GATE: GAP1.D1(JTAG_TMS/GPIO84/USART4_CTS) ; port JTAG_GAP9.TMS/CS_RAM_GATE
RESET_N: GAP1.D4(RESET_N) R22.1 ; port JTAG_GAP9.RESET_N

Not connected (* = marked no-connect by the designer): GAP1 C3(SLOW_XTAL_A) C4(SLOW_XTAL_B); Y2 4(NC)

### Notes on the sheet
- 1
- 2
- 3
- 4
- 5
- 6
- 7
- 8
- A
- B
- C
- D
- Project:
- Date:
- Drawing number:
- Rev:
- Format:
- A3
- Drawn by:
- Laboratory:
- Page
- Sheet:
- of
- File:

### Library data of the parts
C3 C4 = CBR02C200F5GAC: No Description Available; Mfr_Name: Kemet; Type: DEV; Copyright: Copyright (C) 2022 Ultra Librarian. All rights reserved.; Manufacturer_Part_Number: CBR02C200F5GAC; RefDes: RefDes
R22 = CMP-1010-00642-1: 100K 0.05W 1% 0201 (0603 Metric)  SMD; Case-EIA: 0201; Value: 100000.00 Ohm; Case-Metric: 0603; Technology: SMT; Power: 0.05 W; Tolerance: 1 %
Y2 = ECS-240-10-47Q-CES-TR: 24MHz Â±10ppm Crystal 10pF 150 Ohms 4-SMD, No Lead; MF: ECS Inc.; Value: *; SnapEDA_Link: https://www.snapeda.com/parts/ECS-240-10-47Q-CES-TR/ECS%20Inc./view-part/4221464/?ref=snap; Price: None; Availability: Unavailable; Package: SMD-4 ECS International; MP: ECS-240-10-47Q-CES-TR

## Sheet 03_GAP_MEM.SchDoc: SENSEI Base Board - GAP Memory
size A3; DrawnBy: Sebastian Frey; Organization: Integrated Systems Laboratory; DocumentNumber: 4; Revision: v1.1; SheetNumber: 4; SheetTotal: 12
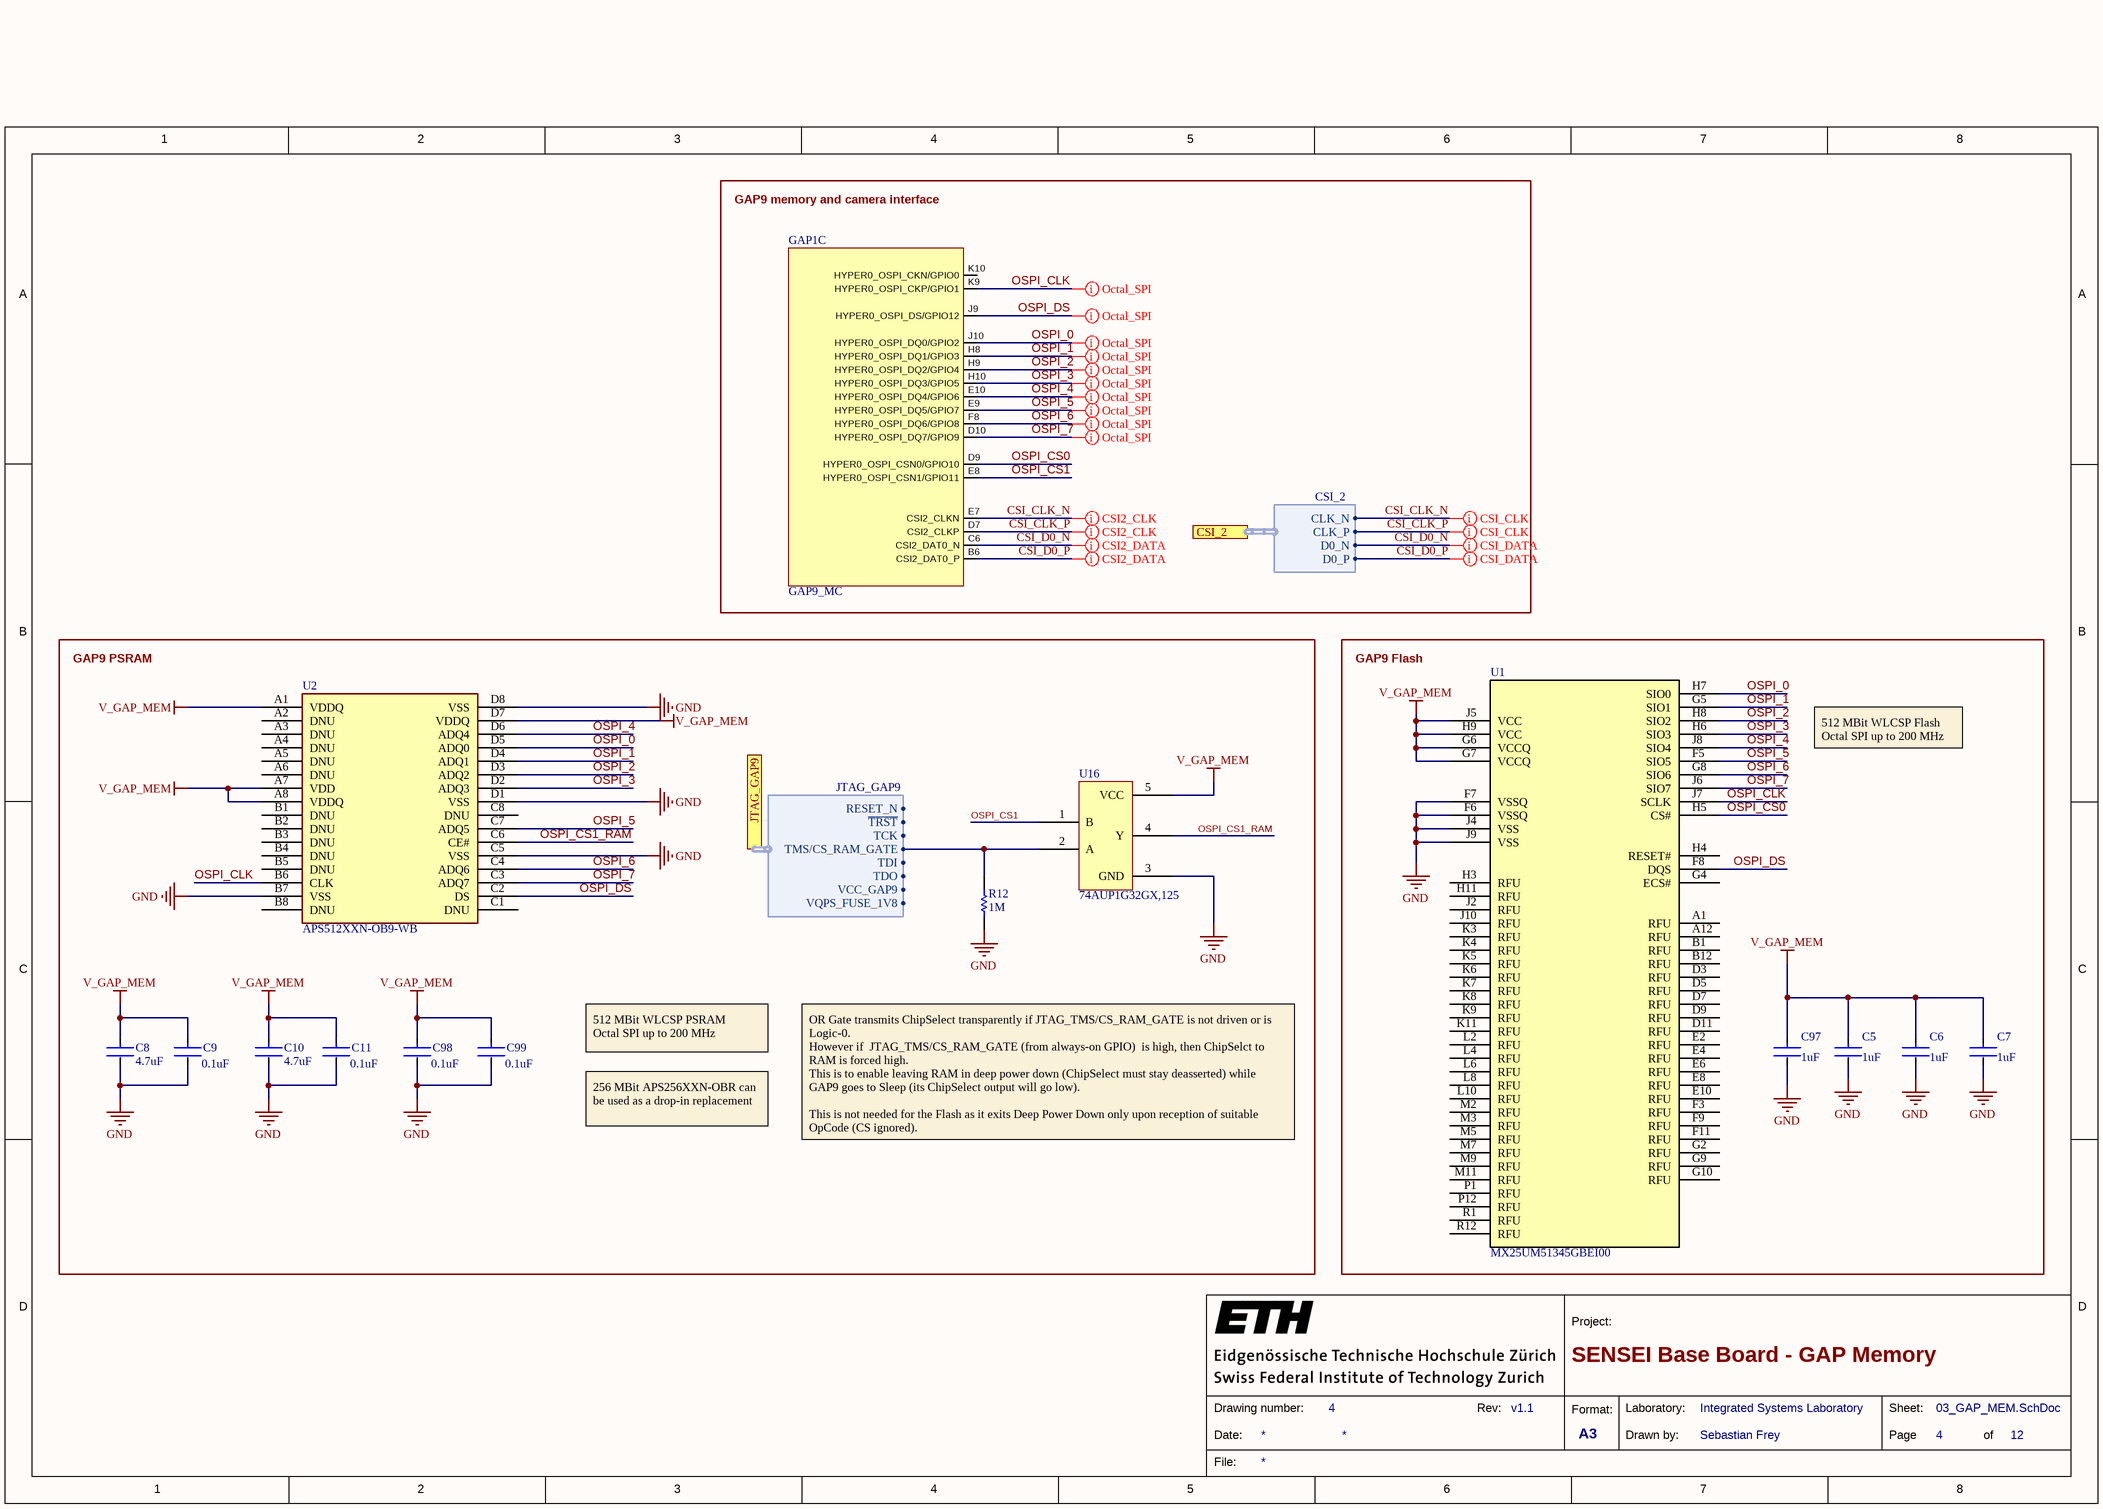
[diagram p3: 03_GAP_MEM.SchDoc]

### Parts
C5  Capacitance: 1uF  [FP-CL03-IPC_C]  (hidden comment: CL03A105KP3NSNC)
C6  Capacitance: 1uF  [FP-CL03-IPC_C]  (hidden comment: CL03A105KP3NSNC)
C7  Capacitance: 1uF  [FP-CL03-IPC_C]  (hidden comment: CL03A105KP3NSNC)
C8  Capacitance: 4.7uF  [FP-C1005-050-0_15-IPC_C]  (hidden comment: C1005X5R0J475K050BC)
C9  Capacitance: 0.1uF  [FP-GRM033-0_03-IPC_C]  (hidden comment: GRM033Z71C104KE14D)
C10  Capacitance: 4.7uF  [FP-C1005-050-0_15-IPC_C]  (hidden comment: C1005X5R0J475K050BC)
C11  Capacitance: 0.1uF  [FP-GRM033-0_03-IPC_C]  (hidden comment: GRM033Z71C104KE14D)
C97  Capacitance: 1uF  [FP-CL03-IPC_C]  (hidden comment: CL03A105KP3NSNC)
C98  Capacitance: 0.1uF  [FP-GRM033-0_03-IPC_C]  (hidden comment: GRM033Z71C104KE14D)
C99  Capacitance: 0.1uF  [FP-GRM033-0_03-IPC_C]  (hidden comment: GRM033Z71C104KE14D)
GAP1  GAP9_MC  [GAP9]  (part C of 5)
R12  value 1M  [RESC0201(0603)_L]  (hidden comment: ERJ-1GNJ105C)
U1  MX25UM51345GBEI00  [MX25UM51345GBEI00]
U2  APS512XXN-OB9-WB  [WLCSP32_APS512XXN-OB9-WB]
U16  74AUP1G32GX,125  [SOT1226-3]

### Blocks framed on the sheet
GAP9 memory and camera interface: GAP1
GAP9 PSRAM: C8-C11 C98 C99 R12 U2 U16
GAP9 Flash: C5-C7 C97 U1

### Ports
CSI_2 (harness CSI_2), JTAG_GAP9 (harness JTAG_GAP9)

### Harnesses
CSI_2: CLK_N, CLK_P, D0_P, D0_N
JTAG_GAP9: ~{TRST}, TCK, TMS/CS_RAM_GATE, TDI, TDO, VCC_GAP9, RESET_N, VQPS_FUSE_1V8

### Nets
GND: C5.2 C6.2 C7.2 C8.2 C9.2 C10.2 C11.2 C97.2 C98.2 C99.2 R12.1 U1.F6(VSSQ) U1.F7(VSSQ) U1.J4(VSS) U1.J9(VSS) U2.B7(VSS) U2.C5(VSS) U2.D1(VSS) U2.D8(VSS) U16.3(GND)
V_GAP_MEM: C5.1 C6.1 C7.1 C8.1 C9.1 C10.1 C11.1 C97.1 C98.1 C99.1 U1.G6(VCCQ) U1.G7(VCCQ) U1.H9(VCC) U1.J5(VCC) U2.A1(VDDQ) U2.A7(VDD) U2.A8(VDDQ) U2.D7(VDDQ) U16.5(VCC)
CSI_CLK_N: GAP1.E7(CSI2_CLKN) ; port CSI_2.CLK_N
CSI_CLK_P: GAP1.D7(CSI2_CLKP) ; port CSI_2.CLK_P
CSI_D0_N: GAP1.C6(CSI2_DAT0_N) ; port CSI_2.D0_N
CSI_D0_P: GAP1.B6(CSI2_DAT0_P) ; port CSI_2.D0_P
JTAG_TMS/CS_RAM_GATE: R12.2 U16.2(A) ; port JTAG_GAP9.TMS/CS_RAM_GATE
OSPI_0: GAP1.J10(HYPER0_OSPI_DQ0/GPIO2) U1.H7(SIO0) U2.D5(ADQ0)
OSPI_1: GAP1.H8(HYPER0_OSPI_DQ1/GPIO3) U1.G5(SIO1) U2.D4(ADQ1)
OSPI_2: GAP1.H9(HYPER0_OSPI_DQ2/GPIO4) U1.H8(SIO2) U2.D3(ADQ2)
OSPI_3: GAP1.H10(HYPER0_OSPI_DQ3/GPIO5) U1.H6(SIO3) U2.D2(ADQ3)
OSPI_4: GAP1.E10(HYPER0_OSPI_DQ4/GPIO6) U1.J8(SIO4) U2.D6(ADQ4)
OSPI_5: GAP1.E9(HYPER0_OSPI_DQ5/GPIO7) U1.F5(SIO5) U2.C7(ADQ5)
OSPI_6: GAP1.F8(HYPER0_OSPI_DQ6/GPIO8) U1.G8(SIO6) U2.C4(ADQ6)
OSPI_7: GAP1.D10(HYPER0_OSPI_DQ7/GPIO9) U1.J6(SIO7) U2.C3(ADQ7)
OSPI_CLK: GAP1.K9(HYPER0_OSPI_CKP/GPIO1) U1.J7(SCLK) U2.B6(CLK)
OSPI_CS0: GAP1.D9(HYPER0_OSPI_CSN0/GPIO10) U1.H5(CS#)
OSPI_CS1: GAP1.E8(HYPER0_OSPI_CSN1/GPIO11) U16.1(B)
OSPI_CS1_RAM: U2.C6(CE#) U16.4(Y)
OSPI_DS: GAP1.J9(HYPER0_OSPI_DS/GPIO12) U1.F8(DQS) U2.C2(DS)

Not connected (* = marked no-connect by the designer): GAP1 K10(HYPER0_OSPI_CKN/GPIO0); U1 A1(RFU) A12(RFU) B1(RFU) B12(RFU) D3(RFU) D5(RFU) D7(RFU) D9(RFU) D11(RFU) E2(RFU) E4(RFU) E6(RFU) E8(RFU) E10(RFU) F3(RFU) F9(RFU) F11(RFU) G2(RFU) G4(ECS#) G9(RFU) G10(RFU) H3(RFU) H4(RESET#) H11(RFU) J2(RFU) J10(RFU) K3(RFU) K4(RFU) K5(RFU) K6(RFU) K7(RFU) K8(RFU) K9(RFU) K11(RFU) L2(RFU) L4(RFU) L6(RFU) L8(RFU) L10(RFU) M2(RFU) M3(RFU) M5(RFU) M7(RFU) M9(RFU) M11(RFU) P1(RFU) P12(RFU) R1(RFU) R12(RFU); U2 A2(DNU) A3(DNU) A4(DNU) A5(DNU) A6(DNU) B1(DNU) B2(DNU) B3(DNU) B4(DNU) B5(DNU) B8(DNU) C1(DNU) C8(DNU)

### Layout directives
net class CSI2_CLK: CSI_CLK_N, CSI_CLK_P
net class CSI2_DATA: CSI_D0_N, CSI_D0_P
differential pair: CSI_CLK_N, CSI_CLK_P, CSI_D0_N, CSI_D0_P
net class O_SPI: OSPI_0, OSPI_1, OSPI_2, OSPI_3, OSPI_4, OSPI_5, OSPI_6, OSPI_7, OSPI_CLK, OSPI_DS

### Notes on the sheet
- 512 MBit WLCSP Flash
  Octal SPI up to 200 MHz
- 512 MBit WLCSP PSRAM
  Octal SPI up to 200 MHz
- 256 MBit APS256XXN-OBR can be used as a drop-in replacement
- OR Gate transmits ChipSelect transparently if JTAG_TMS/CS_RAM_GATE is not driven or is Logic-0.
  However if  JTAG_TMS/CS_RAM_GATE (from always-on GPIO)  is high, then ChipSelct to RAM is forced high.
  This is to enable leaving RAM in deep power down (ChipSelect must stay deasserted) while GAP9 goes to Sleep (its ChipSelect output will go low).
  This is not needed for the Flash as it exits Deep Power Down only upon reception of suitable OpCode (CS ignored).
- 1
- 2
- 3
- 4
- 5
- 6
- 7
- 8
- A
- B
- C
- D
- Project:
- Date:
- Drawing number:
- Rev:
- Format:
- A3
- Drawn by:
- Laboratory:
- Page
- Sheet:
- of
- File:

### Library data of the parts
C5-C7 C97 = CMP-13271-003594-1: as C12 on sheet 00_POWER; Min Operating Temperature: -55°C; Mount: Surface Mount; Packaging: Cut Tape; Width: 0.012inch; Tolerance: 10%; Case Code (Imperial): 0201; Thickness: 0.013inch; Length: 0.024inch; Case/Package: 0201; Max Operating Temperature: 85°C; Voltage Rating: 10V; Case Code (Metric): 0603
C8 C10 = CMP-2000-05437-2: as C13 on sheet 00_POWER; Voltage: 6.3V; Depth: 0.5mm; Height: 0.5mm; Length: 1mm; Termination: SMD/SMT; RoHS Compliant: Yes; Series: C; Case/Package: 0402; Dielectric: X5R; Lead Free: Lead Free; Mount: Surface Mount; Max Operating Temperature: 85°C; Min Operating Temperature: -55°C
C9 C11 C98 C99 = CMP-06035-035508-1: as C19 on sheet 00_POWER; Case/Package: 0201
R12 = CMP-1010-00146-1: as R11 on sheet 00_POWER; Technology: SMT; Tolerance: 5 %; Power: 0.05 W
U1 = MX25UM51345GBEI00: Macronix 512 Mbit WLCSP Flash
U2 = APS512XXN-OB9-WB: 512 Mbit octal SPI PSRAM APmemory; Copyright: Copyright (C) 2022 Ultra Librarian. All rights reserved.; Mfr_Name: AP Memory; Manufacturer_Part_Number: APS512XXN-OB9-WB; RefDes: RefDes; Type: DEV

## Sheet 04_GAP_GPIO.SchDoc: SENSEI Base Board - GAP GPIO
size A3; DrawnBy: Sebastian Frey; Organization: Integrated Systems Laboratory; DocumentNumber: 5; Revision: v1.0; SheetNumber: 5; SheetTotal: 12
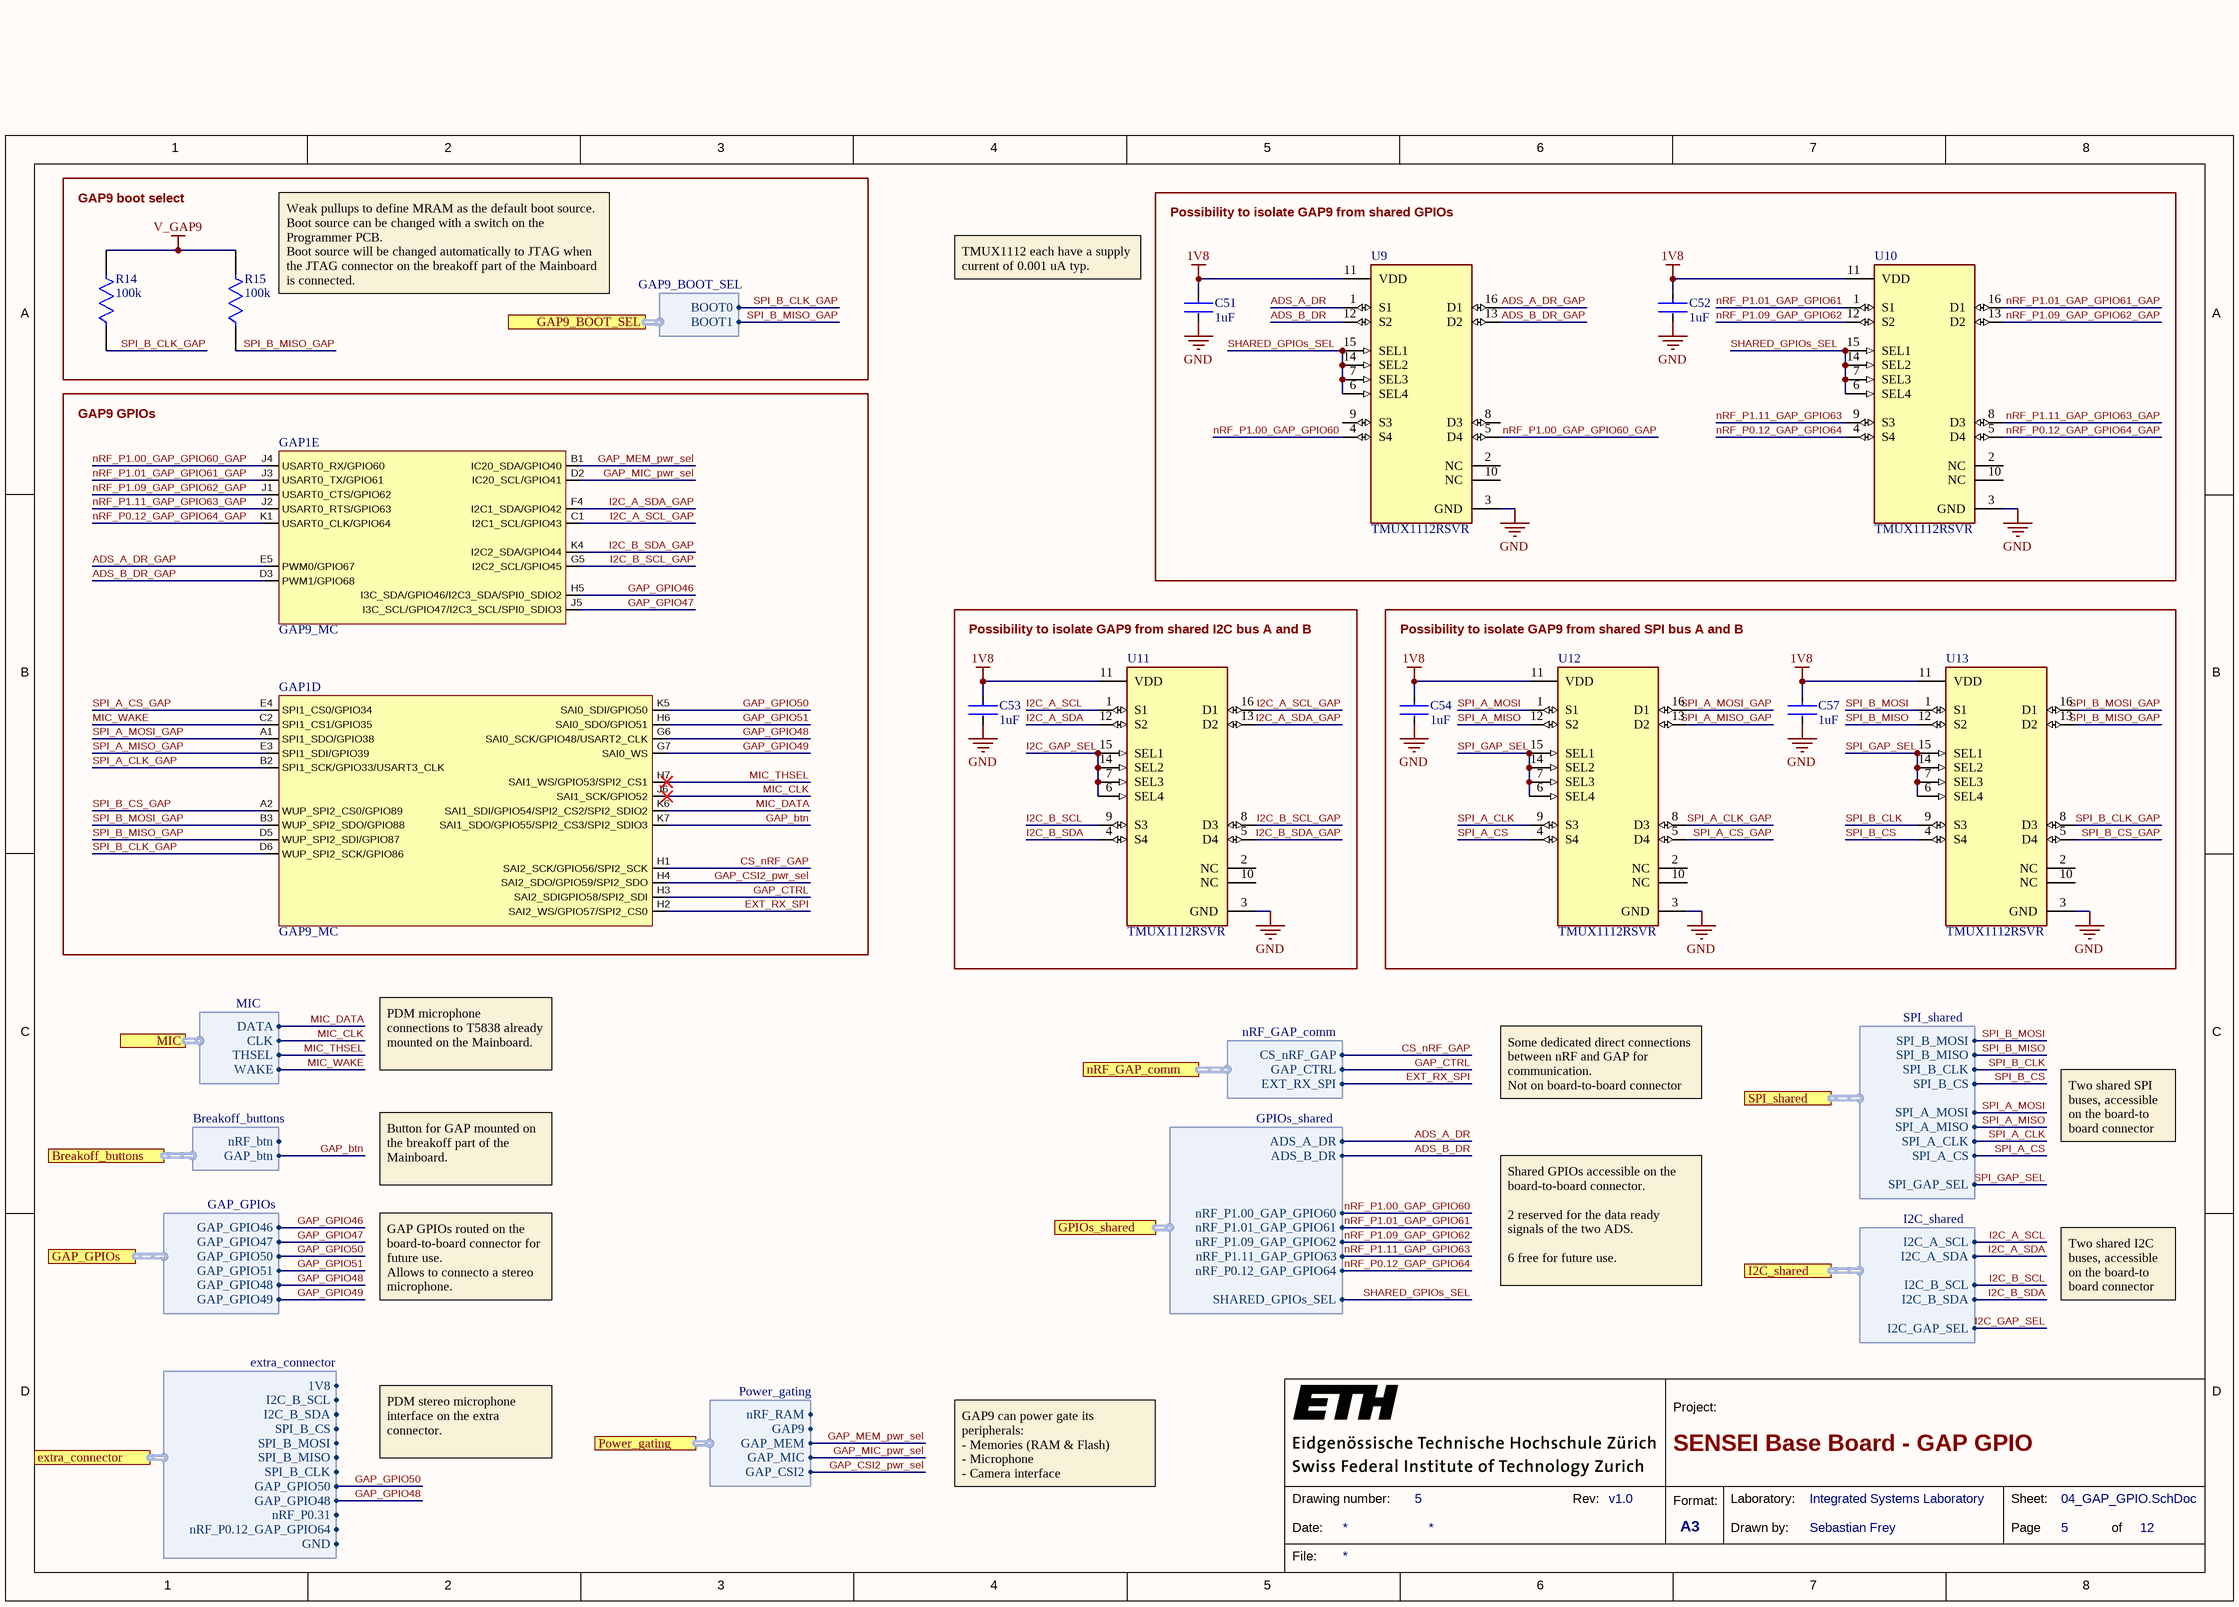
[diagram p4: 04_GAP_GPIO.SchDoc]

### Parts
C51  Capacitance: 1uF  [FP-CL03-IPC_B]  (hidden comment: CL03A105KP3NSNC)
C52  Capacitance: 1uF  [FP-CL03-IPC_B]  (hidden comment: CL03A105KP3NSNC)
C53  Capacitance: 1uF  [FP-CL03-IPC_B]  (hidden comment: CL03A105KP3NSNC)
C54  Capacitance: 1uF  [FP-CL03-IPC_B]  (hidden comment: CL03A105KP3NSNC)
C57  Capacitance: 1uF  [FP-CL03-IPC_B]  (hidden comment: CL03A105KP3NSNC)
GAP1  GAP9_MC  [GAP9]  (parts D,E of 5)
R14  Resistance: 100k  [FP-RR0510-IPC_C]  (hidden comment: RR0510P-104-D)
R15  Resistance: 100k  [FP-RR0510-IPC_C]  (hidden comment: RR0510P-104-D)
U9  TMUX1112RSVR  [FP-RSV0016A-MFG]
U10  TMUX1112RSVR  [FP-RSV0016A-MFG]
U11  TMUX1112RSVR  [FP-RSV0016A-MFG]
U12  TMUX1112RSVR  [FP-RSV0016A-MFG]
U13  TMUX1112RSVR  [FP-RSV0016A-MFG]

### Blocks framed on the sheet
GAP9 boot select: R14 R15
Possibility to isolate GAP9 from shared GPIOs: C51 C52 U9 U10
GAP9 GPIOs: GAP1
Possibility to isolate GAP9 from shared I2C bus A and B: C53 U11
Possibility to isolate GAP9 from shared SPI bus A and B: C54 C57 U12 U13

### Ports
Breakoff_buttons (harness Breakoff_buttons), extra_connector (harness extra_connector), GAP9_BOOT_SEL (harness GAP9_BOOT_SEL), GAP_GPIOs (harness GAP_GPIOs), GPIOs_shared (harness GPIOs_shared), I2C_shared (harness I2C_shared), MIC (harness MIC), nRF_GAP_comm (harness nRF_GAP_comm), Power_gating (harness Power_gating), SPI_shared (harness SPI_shared)

### Harnesses
SPI_shared: SPI_B_MOSI, SPI_B_MISO, SPI_B_CLK, SPI_B_CS, SPI_A_MOSI, SPI_A_MISO, SPI_A_CLK, SPI_A_CS, SPI_GAP_SEL
I2C_shared: I2C_A_SCL, I2C_A_SDA, I2C_B_SCL, I2C_B_SDA, I2C_GAP_SEL
GPIOs_shared: ADS_A_DR, ADS_B_DR, nRF_P1.00_GAP_GPIO60, nRF_P1.09_GAP_GPIO62, nRF_P1.11_GAP_GPIO63, nRF_P0.12_GAP_GPIO64, SHARED_GPIOs_SEL, nRF_P1.01_GAP_GPIO61
nRF_GAP_comm: CS_nRF_GAP, GAP_CTRL, EXT_RX_SPI
MIC: DATA, THSEL, WAKE, CLK
GAP_GPIOs: GAP_GPIO46, GAP_GPIO47, GAP_GPIO50, GAP_GPIO51, GAP_GPIO48, GAP_GPIO49
extra_connector: SPI_B_CS, SPI_B_MOSI, SPI_B_MISO, SPI_B_CLK, GAP_GPIO50, GAP_GPIO48, I2C_B_SDA, nRF_P0.12_GAP_GPIO64, GND, I2C_B_SCL, 1V8, nRF_P0.31
Power_gating: nRF_RAM, GAP9, GAP_MEM, GAP_MIC, GAP_CSI2
GAP9_BOOT_SEL: BOOT0, BOOT1
Breakoff_buttons: nRF_btn, GAP_btn

### Nets
1V8: C51.1 C52.1 C53.1 C54.1 C57.1 U9.11(VDD) U10.11(VDD) U11.11(VDD) U12.11(VDD) U13.11(VDD) ; port extra_connector.1V8
GND: C51.2 C52.2 C53.2 C54.2 C57.2 U9.3(GND) U10.3(GND) U11.3(GND) U12.3(GND) U13.3(GND) ; port extra_connector.GND
V_GAP9: R14.2 R15.2
ADS_A_DR: U9.1(S1) ; port GPIOs_shared.ADS_A_DR
ADS_A_DR_GAP: GAP1.E5(PWM0/GPIO67) U9.16(D1)
ADS_B_DR: U9.12(S2) ; port GPIOs_shared.ADS_B_DR
ADS_B_DR_GAP: GAP1.D3(PWM1/GPIO68) U9.13(D2)
CS_nRF_GAP: GAP1.H1(SAI2_SCK/GPIO56/SPI2_SCK) ; port nRF_GAP_comm.CS_nRF_GAP
EXT_RX_SPI: GAP1.H2(SAI2_WS/GPIO57/SPI2_CS0) ; port nRF_GAP_comm.EXT_RX_SPI
GAP_btn: GAP1.K7(SAI1_SDO/GPIO55/SPI2_CS3/SPI2_SDIO3) ; port Breakoff_buttons.GAP_btn
GAP_CSI2_pwr_sel: GAP1.H4(SAI2_SDO/GPIO59/SPI2_SDO) ; port Power_gating.GAP_CSI2
GAP_CTRL: GAP1.H3(SAI2_SDIGPIO58/SPI2_SDI) ; port nRF_GAP_comm.GAP_CTRL
GAP_GPIO46: GAP1.H5(I3C_SDA/GPIO46/I2C3_SDA/SPI0_SDIO2) ; port GAP_GPIOs.GAP_GPIO46
GAP_GPIO47: GAP1.J5(I3C_SCL/GPIO47/I2C3_SCL/SPI0_SDIO3) ; port GAP_GPIOs.GAP_GPIO47
GAP_GPIO48: GAP1.G6(SAI0_SCK/GPIO48/USART2_CLK) ; port GAP_GPIOs.GAP_GPIO48, port extra_connector.GAP_GPIO48
GAP_GPIO49: GAP1.G7(SAI0_WS) ; port GAP_GPIOs.GAP_GPIO49
GAP_GPIO50: GAP1.K5(SAI0_SDI/GPIO50) ; port GAP_GPIOs.GAP_GPIO50, port extra_connector.GAP_GPIO50
GAP_GPIO51: GAP1.H6(SAI0_SDO/GPIO51) ; port GAP_GPIOs.GAP_GPIO51
GAP_MEM_pwr_sel: GAP1.B1(IC20_SDA/GPIO40) ; port Power_gating.GAP_MEM
GAP_MIC_pwr_sel: GAP1.D2(IC20_SCL/GPIO41) ; port Power_gating.GAP_MIC
I2C_A_SCL: U11.1(S1) ; port I2C_shared.I2C_A_SCL
I2C_A_SCL_GAP: GAP1.C1(I2C1_SCL/GPIO43) U11.16(D1)
I2C_A_SDA: U11.12(S2) ; port I2C_shared.I2C_A_SDA
I2C_A_SDA_GAP: GAP1.F4(I2C1_SDA/GPIO42) U11.13(D2)
I2C_B_SCL: U11.9(S3) ; port I2C_shared.I2C_B_SCL, port extra_connector.I2C_B_SCL
I2C_B_SCL_GAP: GAP1.G5(I2C2_SCL/GPIO45) U11.8(D3)
I2C_B_SDA: U11.4(S4) ; port I2C_shared.I2C_B_SDA, port extra_connector.I2C_B_SDA
I2C_B_SDA_GAP: GAP1.K4(I2C2_SDA/GPIO44) U11.5(D4)
I2C_GAP_SEL: U11.6(SEL4) U11.7(SEL3) U11.14(SEL2) U11.15(SEL1) ; port I2C_shared.I2C_GAP_SEL
MIC_CLK: GAP1.J6(SAI1_SCK/GPIO52) ; port MIC.CLK
MIC_DATA: GAP1.K6(SAI1_SDI/GPIO54/SPI2_CS2/SPI2_SDIO2) ; port MIC.DATA
MIC_THSEL: GAP1.H7(SAI1_WS/GPIO53/SPI2_CS1) ; port MIC.THSEL
MIC_WAKE: GAP1.C2(SPI1_CS1/GPIO35) ; port MIC.WAKE
nRF_P0.12_GAP_GPIO64: U10.4(S4) ; port GPIOs_shared.nRF_P0.12_GAP_GPIO64, port extra_connector.nRF_P0.12_GAP_GPIO64
nRF_P0.12_GAP_GPIO64_GAP: GAP1.K1(USART0_CLK/GPIO64) U10.5(D4)
nRF_P1.00_GAP_GPIO60: U9.4(S4) ; port GPIOs_shared.nRF_P1.00_GAP_GPIO60
nRF_P1.00_GAP_GPIO60_GAP: GAP1.J4(USART0_RX/GPIO60) U9.5(D4)
nRF_P1.01_GAP_GPIO61: U10.1(S1) ; port GPIOs_shared.nRF_P1.01_GAP_GPIO61
nRF_P1.01_GAP_GPIO61_GAP: GAP1.J3(USART0_TX/GPIO61) U10.16(D1)
nRF_P1.09_GAP_GPIO62: U10.12(S2) ; port GPIOs_shared.nRF_P1.09_GAP_GPIO62
nRF_P1.09_GAP_GPIO62_GAP: GAP1.J1(USART0_CTS/GPIO62) U10.13(D2)
nRF_P1.11_GAP_GPIO63: U10.9(S3) ; port GPIOs_shared.nRF_P1.11_GAP_GPIO63
nRF_P1.11_GAP_GPIO63_GAP: GAP1.J2(USART0_RTS/GPIO63) U10.8(D3)
SHARED_GPIOs_SEL: U9.6(SEL4) U9.7(SEL3) U9.14(SEL2) U9.15(SEL1) U10.6(SEL4) U10.7(SEL3) U10.14(SEL2) U10.15(SEL1) ; port GPIOs_shared.SHARED_GPIOs_SEL
SPI_A_CLK: U12.9(S3) ; port SPI_shared.SPI_A_CLK
SPI_A_CLK_GAP: GAP1.B2(SPI1_SCK/GPIO33/USART3_CLK) U12.8(D3)
SPI_A_CS: U12.4(S4) ; port SPI_shared.SPI_A_CS
SPI_A_CS_GAP: GAP1.E4(SPI1_CS0/GPIO34) U12.5(D4)
SPI_A_MISO: U12.12(S2) ; port SPI_shared.SPI_A_MISO
SPI_A_MISO_GAP: GAP1.E3(SPI1_SDI/GPIO39) U12.13(D2)
SPI_A_MOSI: U12.1(S1) ; port SPI_shared.SPI_A_MOSI
SPI_A_MOSI_GAP: GAP1.A1(SPI1_SDO/GPIO38) U12.16(D1)
SPI_B_CLK: U13.9(S3) ; port SPI_shared.SPI_B_CLK, port extra_connector.SPI_B_CLK
SPI_B_CLK_GAP: GAP1.D6(WUP_SPI2_SCK/GPIO86) R14.1 U13.8(D3) ; port GAP9_BOOT_SEL.BOOT0
SPI_B_CS: U13.4(S4) ; port SPI_shared.SPI_B_CS, port extra_connector.SPI_B_CS
SPI_B_CS_GAP: GAP1.A2(WUP_SPI2_CS0/GPIO89) U13.5(D4)
SPI_B_MISO: U13.12(S2) ; port SPI_shared.SPI_B_MISO, port extra_connector.SPI_B_MISO
SPI_B_MISO_GAP: GAP1.D5(WUP_SPI2_SDI/GPIO87) R15.1 U13.13(D2) ; port GAP9_BOOT_SEL.BOOT1
SPI_B_MOSI: U13.1(S1) ; port SPI_shared.SPI_B_MOSI, port extra_connector.SPI_B_MOSI
SPI_B_MOSI_GAP: GAP1.B3(WUP_SPI2_SDO/GPIO88) U13.16(D1)
SPI_GAP_SEL: U12.6(SEL4) U12.7(SEL3) U12.14(SEL2) U12.15(SEL1) U13.6(SEL4) U13.7(SEL3) U13.14(SEL2) U13.15(SEL1) ; port SPI_shared.SPI_GAP_SEL

Not connected (* = marked no-connect by the designer): U9 2(NC) 8(D3) 9(S3) 10(NC); U10 2(NC) 10(NC); U11 2(NC) 10(NC); U12 2(NC) 10(NC); U13 2(NC) 10(NC)

### Notes on the sheet
- (near R15) Weak pullups to define MRAM as the default boot source.
  Boot source can be changed with a switch on the Programmer PCB.
  Boot source will be changed automatically to JTAG when the JTAG connector on the breakoff part of the Mainboard is connected.
- TMUX1112 each have a supply current of 0.001 uA typ.
- PDM microphone connections to T5838 already mounted on the Mainboard.
- Some dedicated direct connections between nRF and GAP for communication.
  Not on board-to-board connector
- Button for GAP mounted on the breakoff part of the Mainboard.
- Two shared SPI buses, accessible on the board-to board connector
- GAP GPIOs routed on the board-to-board connector for future use.
  Allows to connecto a stereo microphone.
- Shared GPIOs accessible on the board-to-board connector.
  2 reserved for the data ready signals of the two ADS.
  6 free for future use.
- Two shared I2C buses, accessible on the board-to board connector
- PDM stereo microphone interface on the extra connector.
- GAP9 can power gate its peripherals:
  - Memories (RAM & Flash)
  - Microphone
  - Camera interface
- 1
- 2
- 3
- 4
- 5
- 6
- 7
- 8
- A
- B
- C
- D
- Project:
- Date:
- Drawing number:
- Rev:
- Format:
- A3
- Drawn by:
- Laboratory:
- Page
- Sheet:
- of
- File:

### Library data of the parts
C51-C54 C57 = CMP-13271-003594-1: as C12 on sheet 00_POWER; Min Operating Temperature: -55°C; Mount: Surface Mount; Packaging: Cut Tape; Width: 0.012inch; Tolerance: 10%; Case Code (Imperial): 0201; Thickness: 0.013inch; Length: 0.024inch; Case/Package: 0201; Max Operating Temperature: 85°C; Voltage Rating: 10V; Case Code (Metric): 0603
R14 R15 = CMP-2002-01533-2: 100kΩ ±0.5% 0.0625W 1/16W Chip Resistor 0402 (1005 Metric) Thin Film; Power Rating: 63mW; Working Voltage: 25V; Temperature Coefficient: 25ppm/°C; Series: RR; Max Operating Temperature: 125°C; RoHS Compliant: Yes; Number of Pins: 2; Width: 0.02inch; Case Code (Imperial): 0402; Voltage Rating (DC): 25V; Length: 0.039inch; Case/Package: 0402; Tolerance: 0.5%; Lead Free: Lead Free; Technology: THIN FILM; Termination: SMD/SMT; Case Code (Metric): 1005; Resistance Tolerance: 0.5%; Resistor Type: Thin Film; Min Operating Temperature: -55°C; Package Quantity: 1; Packaging: Tape and Reel; Height: 0.016inch; REACH SVHC: No SVHC; Number of Terminations: 2; Voltage Rating: 25V; Max Power Dissipation: 63mW
U9-U13 = CMP-04892-000017-1: IC SWITCH; Manufacturer: Texas Instruments; Mux Demux Ratio: 1:1; Throw Configuration: SPST; Max Supply Voltage: 5.5V; Interface: LVCMOS; Nominal Supply Current: 0.008uA; Number Of Circuits: 4; -3Db Bandwith: 300MHz; On State Resistance: 2Ω; Max Junction Temp: +150°C; Min Supply Voltage: 1.08V; Standoff Height: 0mm; ComponentLink2Description: Datasheet; Ambient Temperature Range High: +125°C; ComponentLink2URL: http://www.ti.com/lit/ds/symlink/tmux1111.pdf; Device Class L1: Integrated Circuits (ICs); Device Class L3: Analog Switches; Device Class L2: Interface ICs; Lead Free: Yes; RoHS: TRUE; Temperature: -40°C to +125°C; Temperature Range Low: -40°C; Digikey Description: IC SWITCH; Category: IC; Package: RSV0016A; Octopart: https://octopart.com/tmux1112rsvr-texas+instruments-99389231; Ambient Temperature Range Low: -40°C; Height: 0.55mm; Temperature Range High: +125°C; Manufacturer Part Number: TMUX1112RSVR; Automotive: No

## Sheet 05_GAP_MIC.SchDoc: SENSEI Base Board - GAP MIC
size A3; DrawnBy: Sebastian Frey; Organization: Integrated Systems Laboratory; DocumentNumber: 6; Revision: v1.0; SheetNumber: 6; SheetTotal: 12
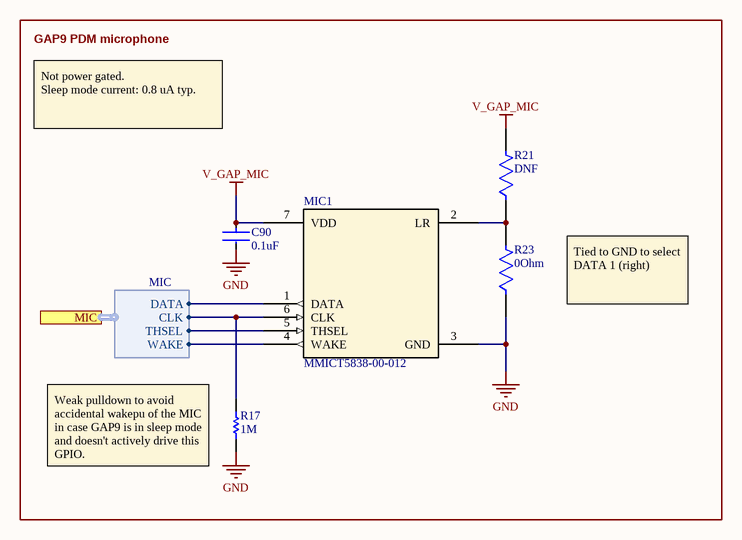
[diagram p5: 05_GAP_MIC.SchDoc]

### Parts
C90  Capacitance: 0.1uF  [FP-GRM033-0_03-IPC_B]  (hidden comment: GRM033Z71C104KE14D)
MIC1  MMICT5838-00-012  [MMICT5838-00-012]
R17  value 1M  [RESC0201(0603)_L]  (hidden comment: ERJ-1GNJ105C)
R21  DNF  [FP-RMCF0201-IPC_C]
R23  Resistance: 0Ohm  [FP-RMCF0201-IPC_C]  (hidden comment: RMCF0201ZT0R00)

### Blocks framed on the sheet
GAP9 PDM microphone: C90 MIC1 R17 R21 R23

### Ports
MIC (harness MIC)

### Harnesses
MIC: DATA, THSEL, WAKE, CLK

### Nets
GND: C90.2 MIC1.3(GND) R17.1 R23.1
V_GAP_MIC: C90.1 MIC1.7(VDD) R21.2
MIC_CLK: MIC1.6(CLK) R17.2 ; port MIC.CLK
MIC_DATA: MIC1.1(DATA) ; port MIC.DATA
MIC_THSEL: MIC1.5(THSEL) ; port MIC.THSEL
MIC_WAKE: MIC1.4(WAKE) ; port MIC.WAKE
NetMIC1_2: MIC1.2(LR) R21.1 R23.2

### Notes on the sheet
- Not power gated.
  Sleep mode current: 0.8 uA typ.
- Tied to GND to select DATA 1 (right)
- (near R17) Weak pulldown to avoid accidental wakepu of the MIC in case GAP9 is in sleep mode and doesn't actively drive this GPIO.
- 1
- 2
- 3
- 4
- 5
- 6
- 7
- 8
- A
- B
- C
- D
- Project:
- Date:
- Drawing number:
- Rev:
- Format:
- A3
- Drawn by:
- Laboratory:
- Page
- Sheet:
- of
- File:

### Library data of the parts
C90 = CMP-06035-035508-1: as C19 on sheet 00_POWER; Case/Package: 0201
MIC1 = MMICT5838-00-012: No Description Available; Mfr_Name: InvenSense; Copyright: Copyright (C) 2023 Ultra Librarian. All rights reserved.; Manufacturer_Part_Number: MMICT5838-00-012; RefDes: RefDes; Type: DEV
R17 = CMP-1010-00146-1: as R11 on sheet 00_POWER; Technology: SMT; Tolerance: 5 %; Power: 0.05 W
R21 = CMP-26527-001890-1
R23 = CMP-26527-001890-1: 0Ω ±0 0.05W 0201 Thick Film Chip Resistor AEC-Q200 compliant; Max Power Dissipation: 50mW; Packaging: Tape and Reel; Case/Package: 0201; Lead Free: Lead Free; Mount: Surface Mount; Series: RMCF; Power Rating: 50mW; Max Operating Temperature: 125°C; Resistor Type: Thick Film; Height - Seated (Max): 0.01inch; Package Quantity: 10000; RoHS Compliant: Yes; Case Code (Metric): 0603; Height: 0.009inch; Radiation Hardening: No; Case Code (Imperial): 0201; Number of Terminations: 2; Contact Plating: Tin; Width: 0.012inch; Min Operating Temperature: -55°C; Length: 0.024inch